# EAGLE board PKG900000001454 (EAGLE 7.7.0), part 1 of 2
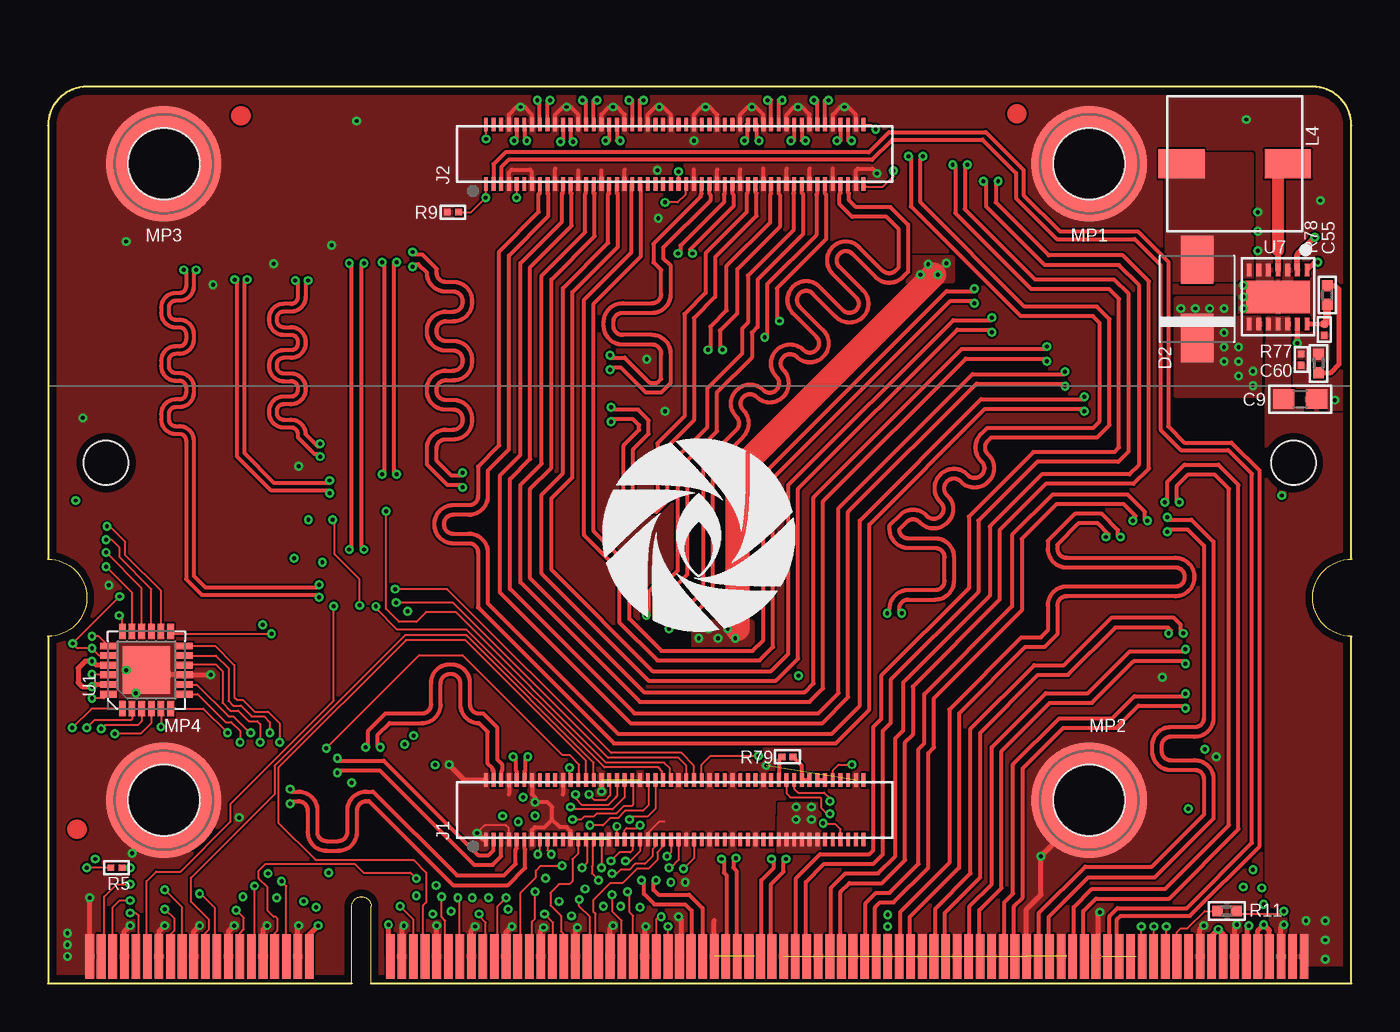
[diagram p5: board, top side]
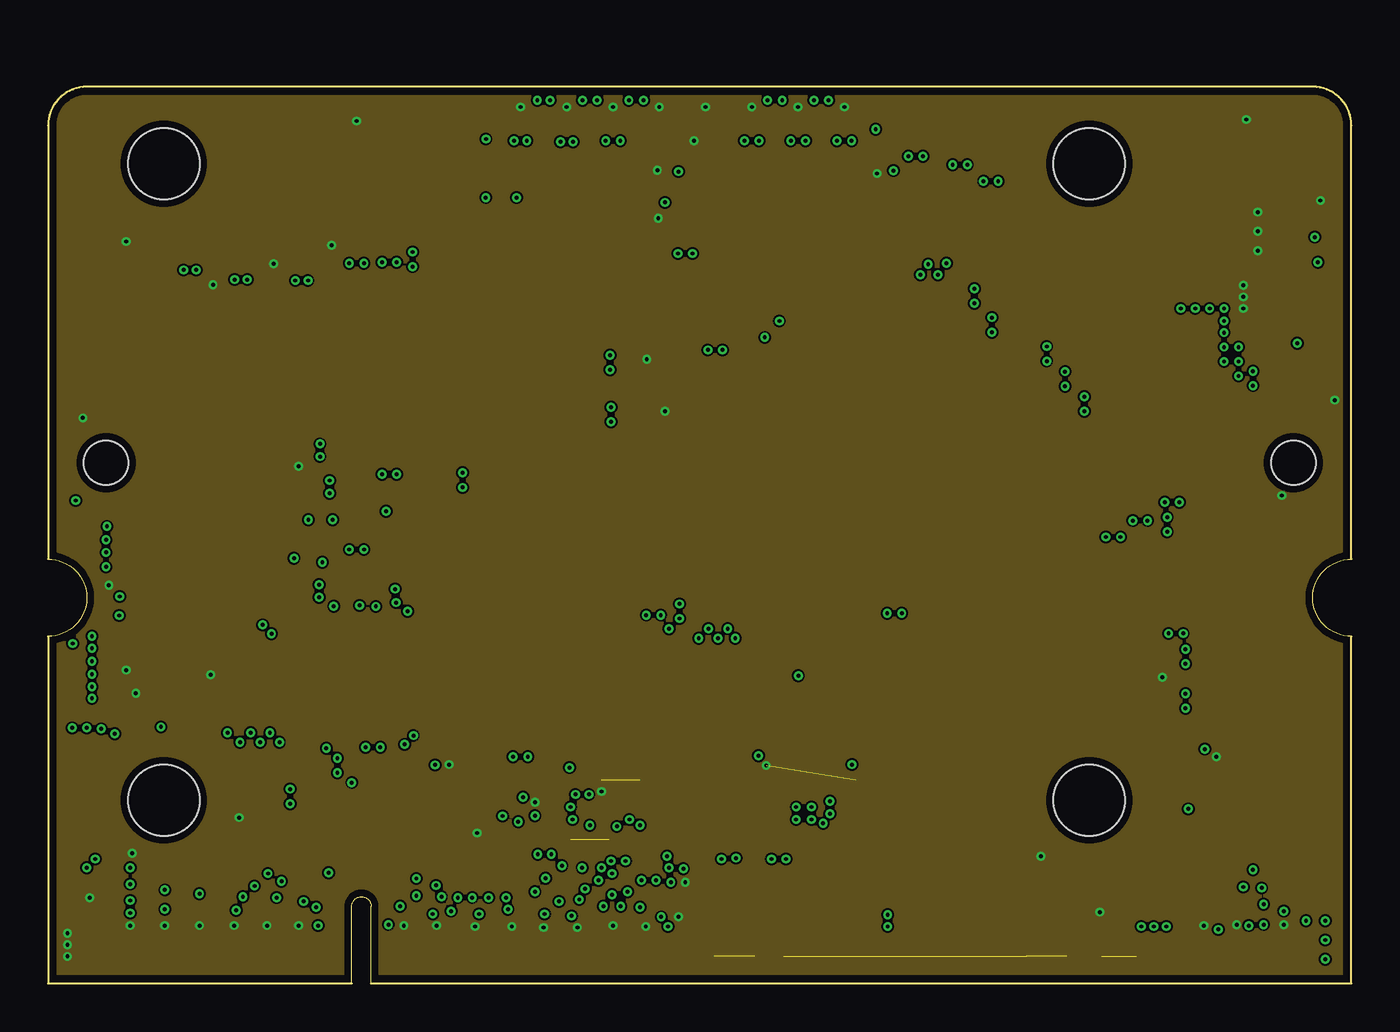
[diagram p6: board, inner layer GND]
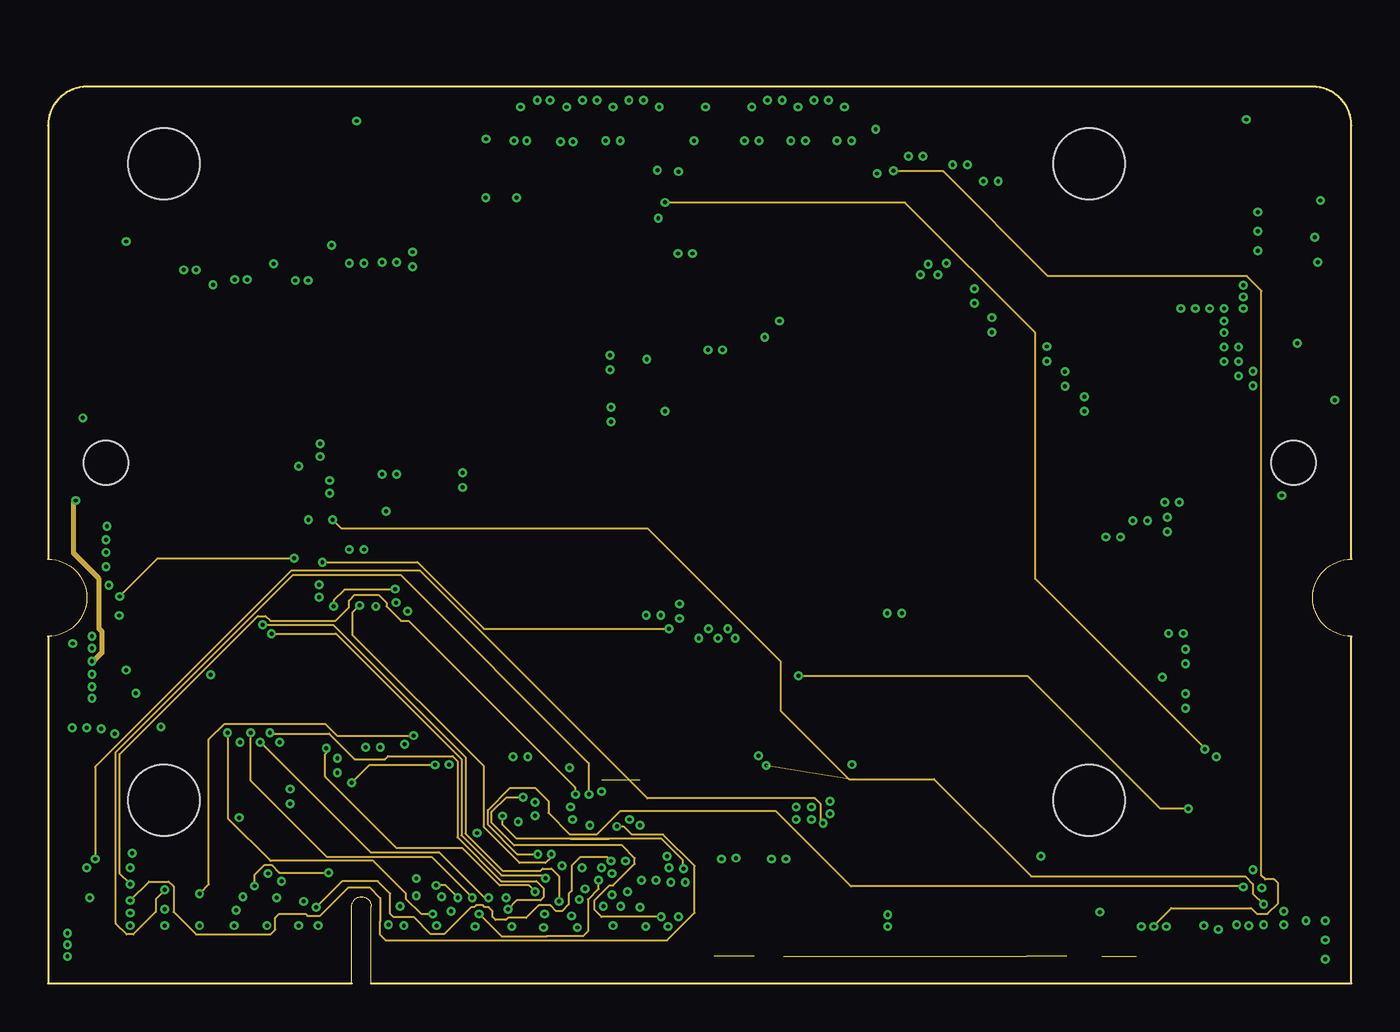
[diagram p7: board, inner layer S3]
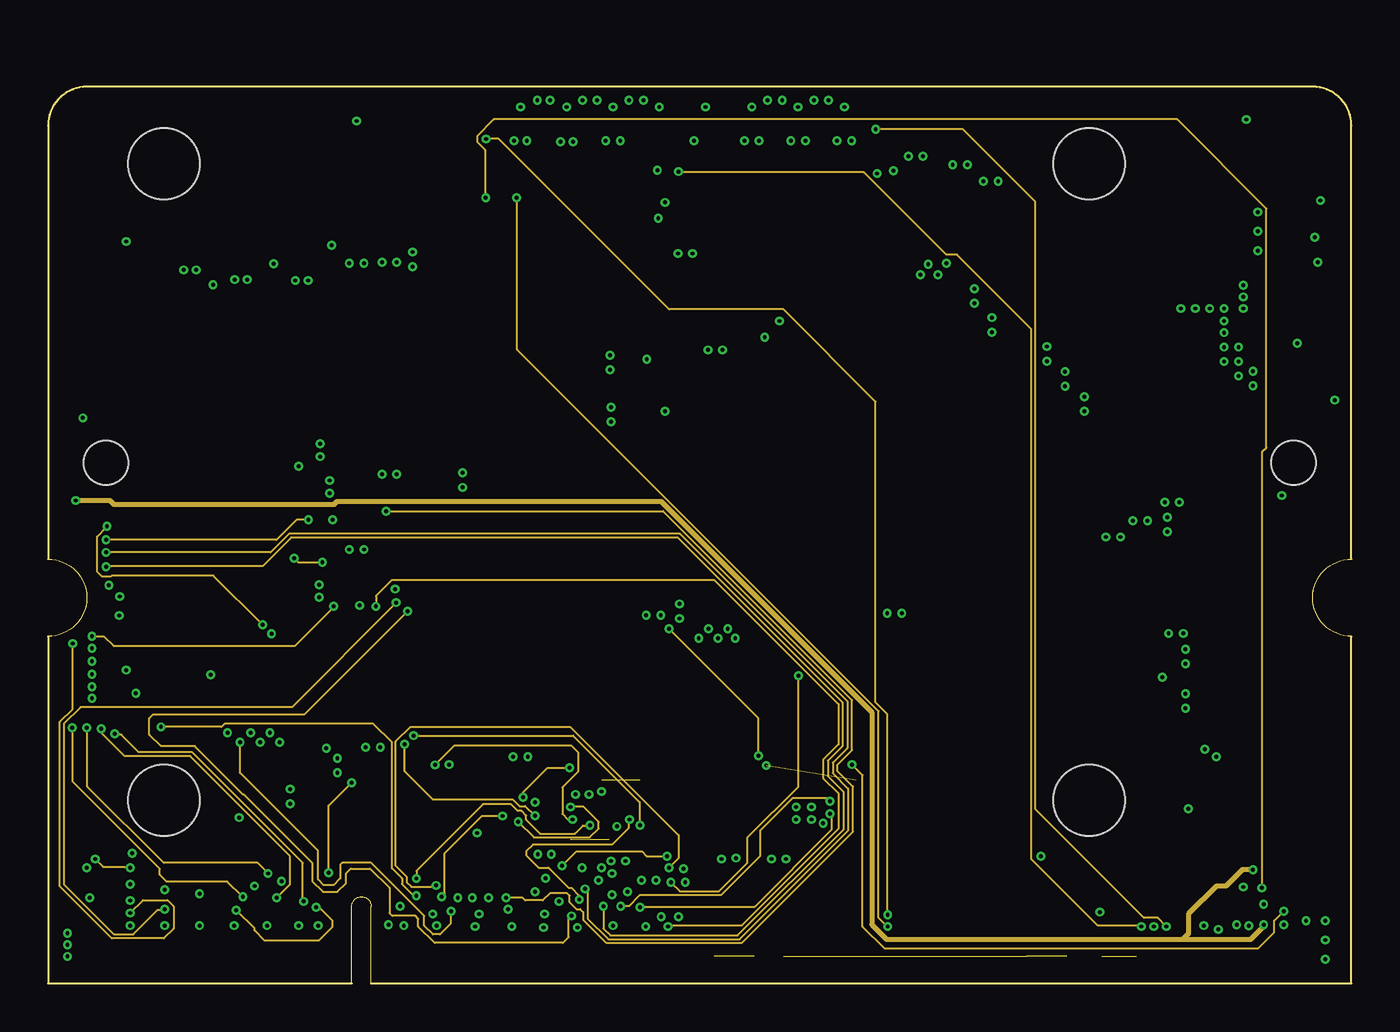
[diagram p8: board, inner layer S14]
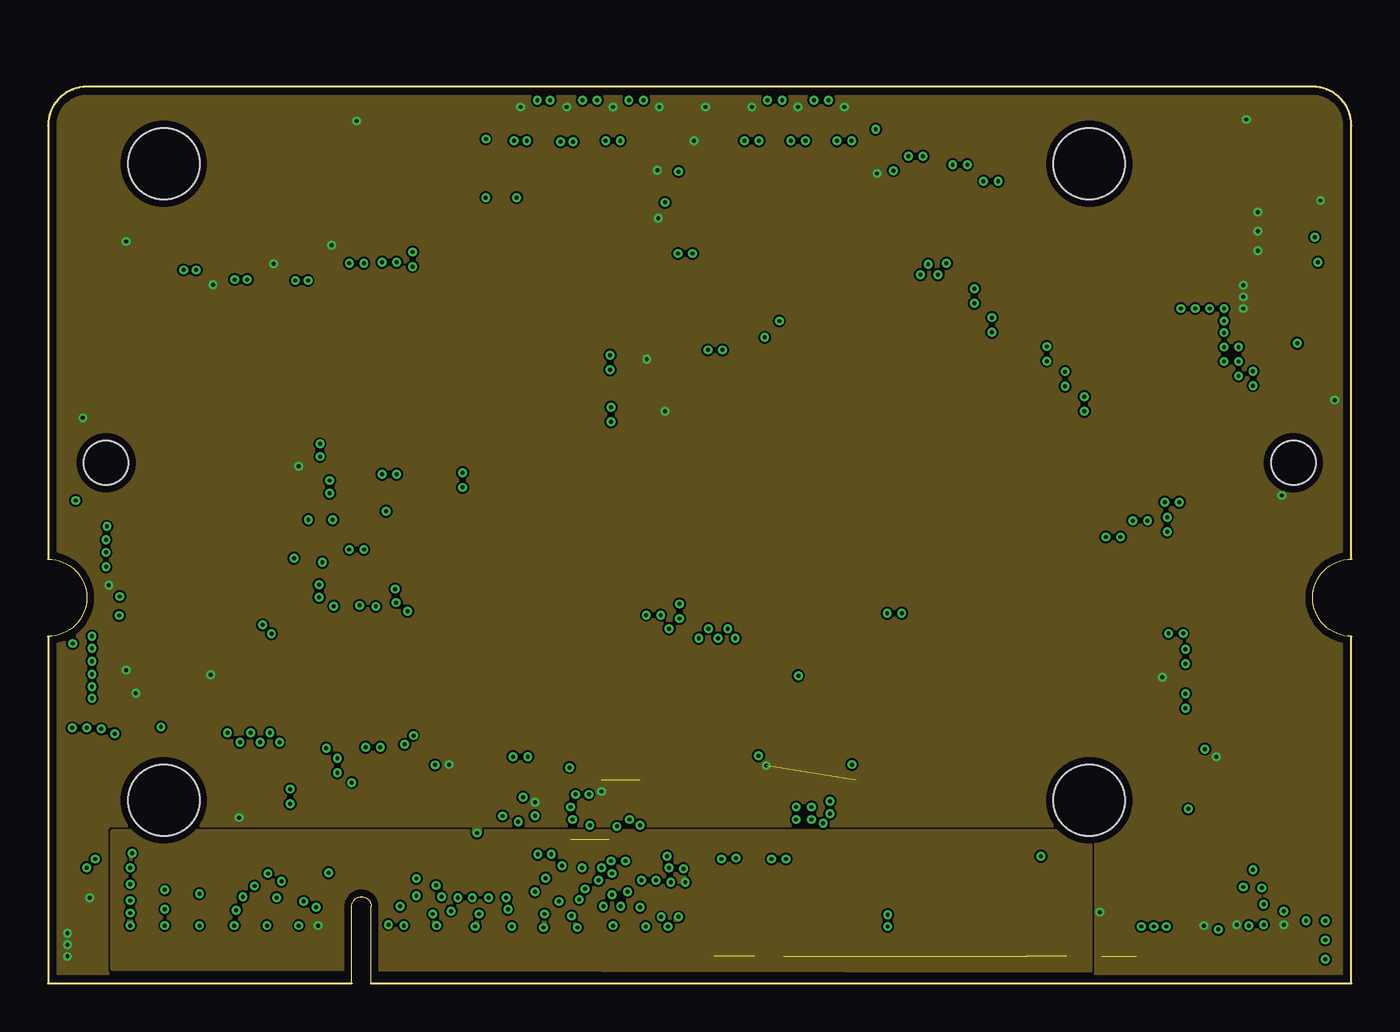
[diagram p9: board, inner layer Power]
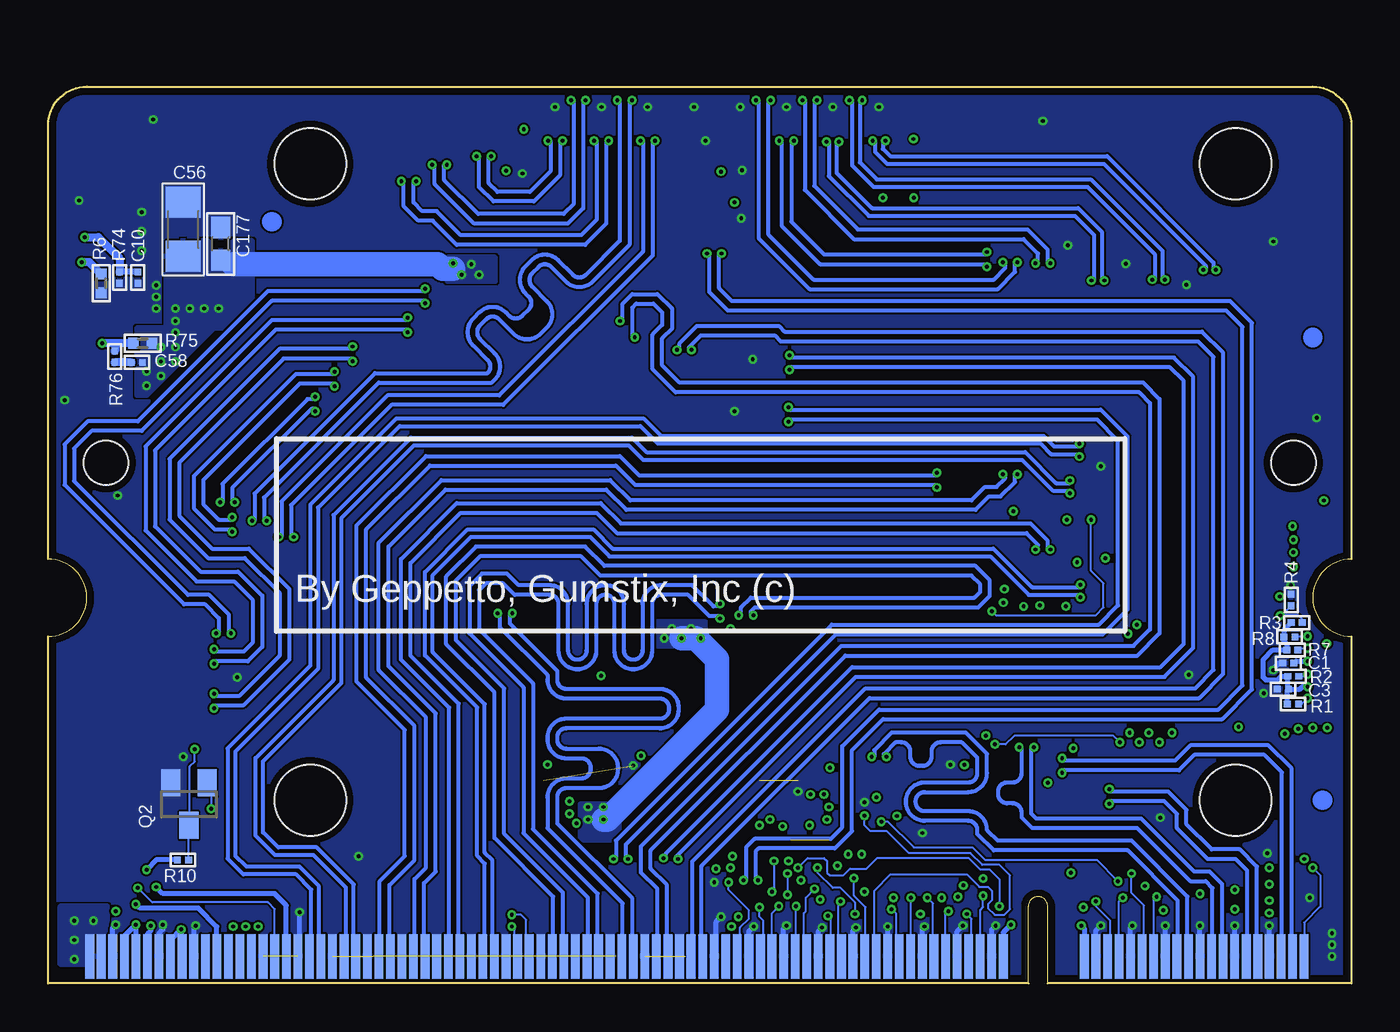
[diagram p10: board, bottom side, seen from below]

Size 67.6 x 46.5 mm. Coordinates in mm from the lower left corner, seen from the top.
Outline: 15.75,0 0,0 0,18
Outline: 16.75,0 67.6,0 67.6,18
Outline: 67.6,22 67.6,44.5 arc90 65.6,46.5 2,46.5 arc90 0,44.5 0,22
Copper layers (1+2*3+14*15+16): Top 0.035mm / dielectric 0.2mm / GND 0.035mm / dielectric 0.2mm / S3 0.035mm / dielectric 0.2mm / S14 0.035mm / dielectric 0.2mm / Power 0.035mm / dielectric 0.2mm / Bottom 0.035mm
Design rules "geppetto": minimum track width 4mil, minimum drill 8mil, track to track 4mil, track to pad 0.15mm, pad to pad 0.15mm, via to via 0.15mm, smd to smd 0mil, copper to edge 15mil, drill to drill 10mil, minimum pad ring 7mil, minimum via ring 5mil, stop-mask expansion 3mil, vias tented up to drill 20mil, thermal gap 0mil
Net classes: 1 supply: width 0.254 mm; 2 analog: width 0.178 mm; 5 USB: width 0.2 mm, clearance 0.2 mm; 6 HDMI: width 0.2 mm, clearance 0.3 mm; 7 50_OHM: width 0.378 mm, clearance 0.3 mm
Holes 2.3 mm at 3,27 64.6,27

## Footprints (pad centres in the part's own frame; a part is rotated, then mirrored left to right if it is on the bottom)
0201 = smd 0.356 x 0.33: 1 -0.292,0; 2 0.292,0
0603 = smd 1.1 x 1: 1 -0.85,0; 2 0.85,0
1206 = smd 1.6 x 1.8: 1 -1.4,0; 2 1.4,0
0402 = smd 0.559 x 0.559: 1 -0.483,0; 2 0.483,0
SMAJ = smd 2.5 x 1.7: A 2.032,0; C -2.032,0
HRS_DF40C-100DS-0.4V(51) = smd 0.2 x 0.7: 1 -9.8,-1.54; 2 -9.8,1.54; 3 -9.4,-1.54; 4 -9.4,1.54; 5 -9,-1.54; 6 -9,1.54; 7 -8.6,-1.54; 8 -8.6,1.54; 9 -8.2,-1.54; 10 -8.2,1.54; 11 -7.8,-1.54; 12 -7.8,1.54; 13 -7.4,-1.54; 14 -7.4,1.54; 15 -7,-1.54; 16 -7,1.54; 17 -6.6,-1.54; 18 -6.6,1.54; 19 -6.2,-1.54; 20 -6.2,1.54; 21 -5.8,-1.54; 22 -5.8,1.54; 23 -5.4,-1.54; 24 -5.4,1.54; 25 -5,-1.54; 26 -5,1.54; 27 -4.6,-1.54; 28 -4.6,1.54; 29 -4.2,-1.54; 30 -4.2,1.54; 31 -3.8,-1.54; 32 -3.8,1.54; 33 -3.4,-1.54; 34 -3.4,1.54; 35 -3,-1.54; 36 -3,1.54; 37 -2.6,-1.54; 38 -2.6,1.54; 39 -2.2,-1.54; 40 -2.2,1.54; 41 -1.8,-1.54; 42 -1.8,1.54; 43 -1.4,-1.54; 44 -1.4,1.54; 45 -1,-1.54; 46 -1,1.54; 47 -0.6,-1.54; 48 -0.6,1.54; 49 -0.2,-1.54; 50 -0.2,1.54; 51 0.2,-1.54; 52 0.2,1.54; 53 0.6,-1.54; 54 0.6,1.54; 55 1,-1.54; 56 1,1.54; 57 1.4,-1.54; 58 1.4,1.54; 59 1.8,-1.54; 60 1.8,1.54; 61 2.2,-1.54; 62 2.2,1.54; 63 2.6,-1.54; 64 2.6,1.54; 65 3,-1.54; 66 3,1.54; 67 3.4,-1.54; 68 3.4,1.54; 69 3.8,-1.54; 70 3.8,1.54; 71 4.2,-1.54; 72 4.2,1.54; 73 4.6,-1.54; 74 4.6,1.54; 75 5,-1.54; 76 5,1.54; 77 5.4,-1.54; 78 5.4,1.54; 79 5.8,-1.54; 80 5.8,1.54; 81 6.2,-1.54; 82 6.2,1.54; 83 6.6,-1.54; 84 6.6,1.54; 85 7,-1.54; 86 7,1.54; 87 7.4,-1.54; 88 7.4,1.54; 89 7.8,-1.54; 90 7.8,1.54; 91 8.2,-1.54; 92 8.2,1.54; 93 8.6,-1.54; 94 8.6,1.54; 95 9,-1.54; 96 9,1.54; 97 9.4,-1.54; 98 9.4,1.54; 99 9.8,-1.54; 100 9.8,1.54
B82462 = smd 2.4 x 1.5: 1 -2.75,0; 2 2.75,0
WA-SMSI_9774___151 = smd 6 x 6: 1 0,0 | hole 3.7: 0,0
SOT23 = smd 1 x 1.4: 1 -0.95,-1.1; 2 0.95,-1.1; 3 0,1.1
WQFN24 = smd 2.45 x 2.45: 25 0,0 | smd 0.8 x 0.35: P1 -2,1.25; P2 -2,0.75; P3 -2,0.25; P4 -2,-0.25; P5 -2,-0.75; P6 -2,-1.25; P13 2,-1.25; P14 2,-0.75; P15 2,-0.25; P16 2,0.25; P17 2,0.75; P18 2,1.25 | smd 0.35 x 0.85: P7 -1.25,-1.975; P8 -0.75,-1.975; P9 -0.25,-1.975; P10 0.25,-1.975; P11 0.75,-1.975; P12 1.25,-1.975; P19 1.25,1.975; P20 0.75,1.975; P21 0.25,1.975; P22 -0.25,1.975; P23 -0.75,1.975; P24 -1.25,1.975
DFN-14 = smd 0.65 x 0.25: 1 -1.4,1.5; 2 -1.4,1; 3 -1.4,0.5; 4 -1.4,0; 5 -1.4,-0.5; 6 -1.4,-1; 7 -1.4,-1.5; 8 1.4,-1.5; 9 1.4,-1; 10 1.4,-0.5; 11 1.4,0; 12 1.4,0.5; 13 1.4,1; 14 1.4,1.5 | smd 1.7 x 3.3: P$1 0,0
SLOT-1376408-1_1.8V_MOD = smd 0.45 x 2.3: 1 2.15,1.4; 3 2.75,1.4; 5 3.35,1.4; 7 3.95,1.4; 9 4.55,1.4; 11 5.15,1.4; 13 5.75,1.4; 15 6.35,1.4; 17 6.95,1.4; 19 7.55,1.4; 21 8.15,1.4; 23 8.75,1.4; 25 9.35,1.4; 27 9.95,1.4; 29 10.55,1.4; 31 11.15,1.4; 33 11.75,1.4; 35 12.35,1.4; 37 12.95,1.4; 39 13.55,1.4; 41 17.75,1.4; 43 18.35,1.4; 45 18.95,1.4; 47 19.55,1.4; 49 20.15,1.4; 51 20.75,1.4; 53 21.35,1.4; 55 21.95,1.4; 57 22.55,1.4; 59 23.15,1.4; 61 23.75,1.4; 63 24.35,1.4; 65 24.95,1.4; 67 25.55,1.4; 69 26.15,1.4; 71 26.75,1.4; 73 27.35,1.4; 75 27.95,1.4; 77 28.55,1.4; 79 29.15,1.4; 81 29.75,1.4; 83 30.35,1.4; 85 30.95,1.4; 87 31.55,1.4; 89 32.15,1.4; 91 32.75,1.4; 93 33.35,1.4; 95 33.95,1.4; 97 34.55,1.4; 99 35.15,1.4; 101 35.75,1.4; 103 36.35,1.4; 105 36.95,1.4; 107 37.55,1.4; 109 38.15,1.4; 111 38.75,1.4; 113 39.35,1.4; 115 39.95,1.4; 117 40.55,1.4; 119 41.15,1.4; 121 41.75,1.4; 123 42.35,1.4; 125 42.95,1.4; 127 43.55,1.4; 129 44.15,1.4; 131 44.75,1.4; 133 45.35,1.4; 135 45.95,1.4; 137 46.55,1.4; 139 47.15,1.4; 141 47.75,1.4; 143 48.35,1.4; 145 48.95,1.4; 147 49.55,1.4; 149 50.15,1.4; 151 50.75,1.4; 153 51.35,1.4; 155 51.95,1.4; 157 52.55,1.4; 159 53.15,1.4; 161 53.75,1.4; 163 54.35,1.4; 165 54.95,1.4; 167 55.55,1.4; 169 56.15,1.4; 171 56.75,1.4; 173 57.35,1.4; 175 57.95,1.4; 177 58.55,1.4; 179 59.15,1.4; 181 59.75,1.4; 183 60.35,1.4; 185 60.95,1.4; 187 61.55,1.4; 189 62.15,1.4; 191 62.75,1.4; 193 63.35,1.4; 195 63.95,1.4; 197 64.55,1.4; 199 65.15,1.4 | smd 0.45 x 2.3 bottom: 2 2.45,1.4; 4 3.05,1.4; 6 3.65,1.4; 8 4.25,1.4; 10 4.85,1.4; 12 5.45,1.4; 14 6.05,1.4; 16 6.65,1.4; 18 7.25,1.4; 20 7.85,1.4; 22 8.45,1.4; 24 9.05,1.4; 26 9.65,1.4; 28 10.25,1.4; 30 10.85,1.4; 32 11.45,1.4; 34 12.05,1.4; 36 12.65,1.4; 38 13.25,1.4; 40 13.85,1.4; 42 18.05,1.4; 44 18.65,1.4; 46 19.25,1.4; 48 19.85,1.4; 50 20.45,1.4; 52 21.05,1.4; 54 21.65,1.4; 56 22.25,1.4; 58 22.85,1.4; 60 23.45,1.4; 62 24.05,1.4; 64 24.65,1.4; 66 25.25,1.4; 68 25.85,1.4; 70 26.45,1.4; 72 27.05,1.4; 74 27.65,1.4; 76 28.25,1.4; 78 28.85,1.4; 80 29.45,1.4; 82 30.05,1.4; 84 30.65,1.4; 86 31.25,1.4; 88 31.85,1.4; 90 32.45,1.4; 92 33.05,1.4; 94 33.65,1.4; 96 34.25,1.4; 98 34.85,1.4; 100 35.45,1.4; 102 36.05,1.4; 104 36.65,1.4; 106 37.25,1.4; 108 37.85,1.4; 110 38.45,1.4; 112 39.05,1.4; 114 39.65,1.4; 116 40.25,1.4; 118 40.85,1.4; 120 41.45,1.4; 122 42.05,1.4; 124 42.65,1.4; 126 43.25,1.4; 128 43.85,1.4; 130 44.45,1.4; 132 45.05,1.4; 134 45.65,1.4; 136 46.25,1.4; 138 46.85,1.4; 140 47.45,1.4; 142 48.05,1.4; 144 48.65,1.4; 146 49.25,1.4; 148 49.85,1.4; 150 50.45,1.4; 152 51.05,1.4; 154 51.65,1.4; 156 52.25,1.4; 158 52.85,1.4; 160 53.45,1.4; 162 54.05,1.4; 164 54.65,1.4; 166 55.25,1.4; 168 55.85,1.4; 170 56.45,1.4; 172 57.05,1.4; 174 57.65,1.4; 176 58.25,1.4; 178 58.85,1.4; 180 59.45,1.4; 182 60.05,1.4; 184 60.65,1.4; 186 61.25,1.4; 188 61.85,1.4; 190 62.45,1.4; 192 63.05,1.4; 194 63.65,1.4; 196 64.25,1.4; 198 64.85,1.4; 200 65.45,1.4

## Placement (x,y rotation side)
C1  0.1uF  [0201]  3.27,16.61 180 bottom
C3  0.1uF  [0201]  3.55,15.26 180 bottom
C9  10uF  [0603]  64.95,30.3 0 top
C10  0.1uF  [0201]  62.95,36.6 270 bottom
C55  10pF  [0201]  66.2,33.9 270 top
C56  100uF  [1206]  60.6,39.1 90 bottom
C58  47pF  [0201]  63,32.2 180 bottom
C60  1nF  [0402]  65.9,32.15 90 top
C177  4.7uF  [0603]  58.65,38.35 90 bottom
D2  MBRA140T3G  [SMAJ]  59.6,35.5 90 top
FD1  DNP  [FIDUCIAL]  1.5,8 0 top
FD2  DNP  [FIDUCIAL]  50.25,45.1 0 top
FD3  DNP  [FIDUCIAL]  10,45 0 top
FD4  DNP  [FIDUCIAL]  2,33.5 0 bottom
FD5  DNP  [FIDUCIAL]  56,39.5 0 bottom
FD6  DNP  [FIDUCIAL]  1.5,9.5 0 bottom
J1  DF40C-100DS-0.4V(51)  [HRS_DF40C-100DS-0.4V(51)]  32.5,9 0 top
J2  DF40C-100DS-0.4V(51)  [HRS_DF40C-100DS-0.4V(51)]  32.5,43 0 top
L4  4.7uH  [B82462]  61.55,42.5 180 top
MP1  9774015151R  [WA-SMSI_9774___151]  54,42.5 180 top
MP2  9774015151R  [WA-SMSI_9774___151]  54,9.5 180 top
MP3  9774015151R  [WA-SMSI_9774___151]  6,42.5 180 top
MP4  9774015151R  [WA-SMSI_9774___151]  6,9.5 180 top
Q2  BSS138  [SOT23]  60.3,9.3 180 bottom
R1  10K 1%  [0201]  3.03,14.49 180 bottom
R2  10K 1%  [0201]  3.01,15.93 180 bottom
R3  DNP  [0201]  2.83,18.71 180 bottom
R4  0R  [0201]  3.12,19.88 270 bottom
R5  0R  [0201]  3.55,6 180 top
R6  33K2  [0402]  64.85,36.3 90 bottom
R7  DNP  [0201]  3.06,17.29 180 bottom
R8  DNP  [0201]  3.21,17.97 180 bottom
R9  DNP  [0201]  21,40 0 top
R10  10K 1%  [0201]  60.6,6.4 180 bottom
R11  220R  [0402]  61.15,3.75 0 top
R74  180K  [0201]  63.9,36.6 90 bottom
R75  560K  [0402]  62.7,33.2 0 bottom
R76  0R  [0201]  64.15,32.5 270 bottom
R77  180K  [0201]  65,32.35 90 top
R78  8K2  [0402]  66.35,35.7 270 top
R79  0R  [0201]  38.35,11.75 180 top
U1  TCA6416A  [WQFN24]  5.1,16.25 90 top
U7  LTC3533  [DFN-14]  63.8,35.6 270 top
U$3  DNP  [GEPPETTO_LABEL]  55.75,18.25 0 bottom
U$4  DNP  [GEPPETTO_LOGO_SILK10]  33.75,23.25 0 top
X1  DNP  [SLOT-1376408-1_1.8V_MOD]  0,0 0 top

## Tracks (layer width: path | path; a pad name or v marks a point on that pad's centre or on a via)
1.3.3V_VCC_3.3  (via drill 0.2)
  Top 0.254: U1.P21 2.48,16.5 v2.27,16.71 1.91,16.71 1.55,16.35 1.55,15.6 1.76,15.39 v2.27,15.39 2.38,15.5 U1.P23 | X1.191 62.75,2.75 v63.05,3.05 63.35,2.75 X1.193
  S3 0.254: v1.42,25.04 1.32,25.04 1.32,22.3 2.64,20.98 2.64,18.39 2.79,18.24 2.79,17.17 2.33,16.71 v2.27,16.71
  S14 0.254: 58.85,2.29 43.48,2.29 42.72,3.05 42.72,14.07 31.8,24.99 14.99,24.99 14.83,24.84 3.4,24.84 3.2,25.04 v1.42,25.04 | 58.85,2.29 62.38,2.29 63.04,2.95 v63.04,3.05 v63.05,3.05 | v62.5,5.9 61.95,5.9 61.1,5.05 60.6,5.05 59.15,3.6 59.15,2.59 58.85,2.29
  Bottom 0.254: C1.1 2.88,16.71 v2.27,16.71 | R3.2 3.5,18.33 R8.2 3.5,17.75 3.35,17.6 R7.2 4.06,17.29 4.58,16.77 4.58,15.88 4.44,15.74 3.82,15.74 3.63,15.93 R2.2 3.3,15.3 C3.1 | C3.1 2.67,15.26 2.54,15.39 v2.27,15.39 | R1.2 3.32,15.2 C3.1 | X1.192 v63.05,3.05 63.65,2.45 X1.194 | R10.2 62,6.4 v62.5,5.9
1.8V_OUT$2
  Top 0.2: J1.90 J1.88
1.VBAT_VCC_3.3  (via drill 0.2)
  other vias: 65.25,3.25 66.25,3.25 66.25,2.25 66.25,1.25
  pour Top: 64.35,34.5 64.3,29.6 63.25,29.6 63.3,34.5
  pour Top: 67.25,1 64.5,1 64.5,4 63.25,4 63.25,30 65,30 65,29.5 67.25,29.5
  pour Bottom: 67,1 64.5,1 64.5,4 67,4
1V8  (via drill 0.2)
  Top 0.254: X1.183 60.35,2.45 v60.7,2.8 60.95,2.55 X1.185
  Bottom 0.254: X1.184 60.7,1.45 v60.7,2.8 61.25,2.25 X1.186
2.CAM0_C_N  (via drill 0.2)
  Top 0.2: J2.40 30.3,45.8 v30.12,45.8 30.25,45.8 | v18.08,26.4 17.95,26.4 17.95,37.4 v18.08,37.4
  Bottom 0.2: v30.12,45.8 30.25,45.8 30.25,38.85 27.9,36.5 18.55,36.5 17.95,37.1 17.95,37.4 v18.08,37.4 | v18.08,26.4 17.95,26.4 17.95,26.2 18.4,25.75 19,25.75 19.7,25.05 37.4,25.05 38.45,26.1 47.2,26.1 50.45,22.85 50.45,16.25 48,13.8 48,6 48.6,5.4 48.6,1.45 X1.144
2.CAM0_C_P  (via drill 0.2)
  Top 0.2: J2.42 30.7,45.8 v30.88,45.8 30.75,45.8 | v17.32,26.4 17.45,26.4 17.45,37.4 v17.32,37.4
  Bottom 0.2: v30.88,45.8 30.75,45.8 30.75,38.65 28.1,36 18.35,36 17.45,36.9 17.45,37.4 v17.32,37.4 | v17.32,26.4 17.45,26.4 17.45,26 18.2,25.25 18.8,25.25 19.5,24.55 37.6,24.55 38.65,25.6 47,25.6 49.95,22.65 49.95,16.45 47.5,14 47.5,5.8 48.1,5.2 48.1,1.45 X1.142
2.CAM0_D1_N  (via drill 0.2)
  Top 0.2: J2.28 27.9,45.8 v27.72,45.8 27.85,45.8 | v15.62,37.35 15.75,37.35 15.75,22.5 v15.62,22.5
  Bottom 0.2: v27.72,45.8 27.85,45.8 27.85,41.35 25.6,39.1 16.8,39.1 15.75,38.05 15.75,37.35 v15.62,37.35 | X1.138 46.8,1.45 46.8,14.3 49.3,16.8 49.3,22 46.4,24.9 38.95,24.9 37.9,23.85 16.65,23.85 15.75,22.95 15.75,22.5 v15.62,22.5
2.CAM0_D1_P  (via drill 0.2)
  Top 0.2: J2.30 28.3,45.8 v28.48,45.8 28.35,45.8 | v16.38,37.35 16.25,37.35 16.25,22.5 v16.38,22.5
  Bottom 0.2: v28.48,45.8 28.35,45.8 28.35,41.15 25.8,38.6 17,38.6 16.25,37.85 16.25,37.35 v16.38,37.35 | X1.136 46.3,1.45 46.3,14.5 48.8,17 48.8,21.8 46.2,24.4 39.15,24.4 38.1,23.35 16.85,23.35 16.25,22.75 16.25,22.5 v16.38,22.5
2.CAM0_D2_N  (via drill 0.2)
  Top 0.2: J2.34 29.1,43.7 v28.92,43.7 29.05,43.7 | v18.9,37.93 18.9,37.8 19.4,37.8 20.15,37.05 20.15,36.85 arc90 20.62,36.37 21.03,36.37 arc-90 22,35.4 22,35.32 arc-90 21.03,34.34 20.62,34.34 arc90 20.15,33.87 20.15,33.78 arc90 20.62,33.31 21.03,33.31 arc-90 22,32.34 22,32.26 arc-90 21.03,31.28 20.62,31.28 arc90 20.15,30.8 20.15,30.72 arc90 20.62,30.25 21.03,30.25 arc-90 22,29.27 22,29.19 arc-90 21.03,28.22 20.62,28.22 arc90 20.15,27.74 20.15,27.1 20.9,26.35 21.5,26.35 v21.5,26.48
  Bottom 0.2: v28.92,43.7 29.05,43.7 29.05,39.5 27.35,37.8 18.9,37.8 v18.9,37.93 | v21.5,26.48 21.5,26.35 36.95,26.35 37.95,27.35 48,27.35 51.6,23.75 51.6,15.65 49.1,13.15 49.1,6.6 50.4,5.3 50.4,1.45 X1.150
2.CAM0_D2_P  (via drill 0.2)
  Top 0.2: J2.36 29.5,43.7 v29.68,43.7 29.55,43.7 | v18.9,37.17 18.9,37.3 19.2,37.3 19.65,36.85 arc90 20.62,35.87 21.03,35.87 arc-90 21.5,35.4 21.5,35.32 arc-90 21.03,34.84 20.62,34.84 arc90 19.65,33.87 19.65,33.78 arc90 20.62,32.81 21.03,32.81 arc-90 21.5,32.34 21.5,32.26 arc-90 21.03,31.78 20.62,31.78 arc90 19.65,30.8 19.65,30.72 arc90 20.62,29.75 21.03,29.75 arc-90 21.5,29.27 21.5,29.19 arc-90 21.03,28.72 20.62,28.72 arc90 19.65,27.74 19.65,26.9 20.7,25.85 21.5,25.85 v21.5,25.72
  Bottom 0.2: v29.68,43.7 29.55,43.7 29.55,39.3 27.55,37.3 18.9,37.3 v18.9,37.17 | v21.5,25.72 21.5,25.85 37.15,25.85 38.15,26.85 47.8,26.85 51.1,23.55 51.1,15.85 48.6,13.35 48.6,6.4 49.9,5.1 49.9,1.45 X1.148
2.CAM1_C_N  (via drill 0.2)
  Top 0.2: v51.8,32.27 51.8,32.4 47.6,32.4 40.2,25 40.2,15.3 39.5,14.6 30.7,14.6 24.5,20.8 24.5,25.85 25.6,26.95 25.6,36.7 27.85,38.95 27.85,40.96 27.9,40.96 J2.27 | v59,14.27 59,14.4 56.55,14.4 55.4,13.25 52.65,13.25 50.55,11.15 50.55,4.45 50.1,4 50.1,1.45 X1.149
  Bottom 0.2: v51.8,32.27 51.8,32.4 55.4,32.4 60.8,27 60.8,24.25 59.1,22.55 57.2,22.55 55.1,20.45 55.1,16.8 57.5,14.4 59,14.4 v59,14.27
2.CAM1_C_P  (via drill 0.2)
  Top 0.2: v51.8,33.03 51.8,32.9 47.4,32.9 39.7,25.2 39.7,15.55 39.25,15.1 30.9,15.1 25,21 25,25.65 26.1,26.75 26.1,36.5 28.35,38.75 28.35,40.96 28.3,40.96 J2.29 | v59,15.03 59,14.9 56.35,14.9 55.2,13.75 52.45,13.75 50.05,11.35 50.05,4.65 49.6,4.2 49.6,1.45 X1.147
  Bottom 0.2: v51.8,33.03 51.8,32.9 55.6,32.9 61.3,27.2 61.3,24.05 59.3,22.05 57.4,22.05 55.6,20.25 55.6,17 57.7,14.9 59,14.9 v59,15.03
2.CAM1_D1_N  (via drill 0.2)
  Top 0.2: v53.75,29.67 53.75,29.8 48.6,29.8 42.6,23.8 42.6,14.2 40.85,12.45 29.35,12.45 22.3,19.5 22.3,22.35 arc90 21.82,22.82 21,22.82 arc-90 20.02,23.8 20.02,23.82 arc-90 21,24.8 21.82,24.8 arc90 22.3,25.27 22.3,26.8 23.4,27.9 23.4,37.95 25.45,40 25.45,40.96 25.5,40.96 J2.15 | v57.92,24.95 58.05,24.95 58.05,26 58.95,26.9 60.7,26.9 61.75,25.85 61.75,8 58.15,4.4 54.35,4.4 53.7,3.75 53.7,1.4 X1.161
  Bottom 0.2: v53.75,29.67 53.75,29.8 53.95,29.8 58.05,25.7 58.05,24.95 v57.92,24.95
2.CAM1_D1_P  (via drill 0.2)
  Top 0.2: v53.75,30.43 53.75,30.3 48.4,30.3 42.1,24 42.1,14.4 40.65,12.95 29.55,12.95 22.8,19.7 22.8,22.35 arc90 21.82,23.32 21,23.32 arc-90 20.52,23.8 20.52,23.82 arc-90 21,24.3 21.82,24.3 arc90 22.8,25.27 22.8,26.6 23.9,27.7 23.9,37.75 25.95,39.8 25.95,40.95 25.9,40.95 J2.17 | v58.68,24.95 58.55,24.95 58.55,25.8 59.15,26.4 60.5,26.4 61.25,25.65 61.25,8.2 57.95,4.9 54.15,4.9 53.2,3.95 53.2,1.4 X1.159
  Bottom 0.2: v53.75,30.43 53.75,30.3 54.15,30.3 58.55,25.9 58.55,24.95 v58.68,24.95
2.CAM1_D2_N  (via drill 0.2)
  Top 0.2: v52.75,30.97 52.75,31.1 48.15,31.1 41.5,24.45 41.5,14.85 40.15,13.5 30.2,13.5 23.45,20.25 23.45,26.35 24.5,27.4 24.5,37.35 26.65,39.5 26.65,40.96 26.7,40.96 J2.21 | v58.05,24.18 58.05,24.05 59.3,24.05 60.45,22.9 60.45,13.76 arc-90 59.48,12.79 58.23,12.79 arc90 57.76,12.31 57.76,12.05 arc90 58.23,11.57 59.48,11.57 arc-90 60.45,10.6 60.45,8.55 57.4,5.5 53.95,5.5 51.9,3.45 51.9,1.45 X1.155
  Bottom 0.2: v52.75,30.97 52.75,31.1 54.55,31.1 59.55,26.1 59.55,24.85 58.75,24.05 58.05,24.05 v58.05,24.18
2.CAM1_D2_P  (via drill 0.2)
  Top 0.2: v52.75,31.73 52.75,31.6 47.95,31.6 41,24.65 41,15.05 39.95,14 30.4,14 23.95,20.45 23.95,26.15 25,27.2 25,37.15 27.15,39.3 27.15,40.96 27.1,40.96 J2.23 | v58.05,23.42 58.05,23.55 59.1,23.55 59.95,22.7 59.95,13.76 arc-90 59.48,13.29 58.23,13.29 arc90 57.26,12.31 57.26,12.05 arc90 58.23,11.07 59.48,11.07 arc-90 59.95,10.6 59.95,8.75 57.25,6.05 53.8,6.05 51.4,3.65 51.4,1.45 X1.153
  Bottom 0.2: v52.75,31.73 52.75,31.6 54.75,31.6 60.05,26.3 60.05,24.65 58.95,23.55 58.05,23.55 v58.05,23.42
2.CAM1_D3_N  (via drill 0.2)
  Top 0.2: v48.95,33.77 48.95,33.9 47.15,33.9 38.9,25.65 38.9,16.85 37.75,15.7 31.15,15.7 25.6,21.25 25.6,25.35 26.7,26.45 26.7,36.05 29.05,38.4 29.05,40.96 29.1,40.96 J2.33 | v59,16.57 59,16.7 56.3,16.7 54.15,14.55 51.95,14.55 49.45,12.05 49.45,4.95 48.3,3.8 48.3,1.45 X1.143
  Bottom 0.2: v48.95,33.77 48.95,33.9 55.8,33.9 62.05,27.65 62.05,23.7 59.7,21.35 57.75,21.35 56.5,20.1 56.5,17.45 57.25,16.7 59,16.7 v59,16.57
2.CAM1_D3_P  (via drill 0.2)
  Top 0.2: v48.95,34.53 48.95,34.4 46.95,34.4 38.4,25.85 38.4,17.1 37.5,16.2 31.35,16.2 26.1,21.45 26.1,25.15 27.2,26.25 27.2,35.85 29.55,38.2 29.55,40.96 29.5,40.96 J2.35 | v59,17.33 59,17.2 56.1,17.2 53.95,15.05 51.75,15.05 48.95,12.25 48.95,5.15 47.8,4 47.8,1.45 X1.141
  Bottom 0.2: v48.95,34.53 48.95,34.4 56,34.4 62.55,27.85 62.55,23.5 59.9,20.85 57.95,20.85 57,19.9 57,17.65 57.45,17.2 59,17.2 v59,17.33
2.CAM1_D4_N  (via drill 0.2)
  Top 0.2: v48.05,35.27 48.05,35.4 46.8,35.4 37.6,26.2 37.6,17.45 36.9,16.75 31.6,16.75 29.65,18.7 29.65,21.4 27.8,23.25 27.8,35.45 30.25,37.9 30.25,41.41 J2.39 | v58.12,18.15 58.25,18.15 58.25,18.3 58.1,18.45 55.35,18.45 52.9,16 51.35,16 48.35,13 48.35,5.5 46.5,3.65 46.5,1.45 X1.137
  Bottom 0.2: v48.05,35.27 48.05,35.4 56,35.4 62.75,28.65 65.35,28.65 66.25,27.75 66.25,26.05 60.35,20.15 59.25,20.15 58.25,19.15 58.25,18.15 v58.12,18.15
2.CAM1_D4_P  (via drill 0.2)
  Top 0.2: v48.05,36.03 48.05,35.9 46.6,35.9 37.1,26.4 37.1,17.8 36.55,17.25 31.8,17.25 30.15,18.9 30.15,21.6 28.3,23.45 28.3,35.25 30.75,37.7 30.75,41.41 J2.41 | v58.88,18.15 58.75,18.15 58.75,18.6 58.4,18.95 55.15,18.95 52.7,16.5 51.15,16.5 47.85,13.2 47.85,5.7 46,3.85 46,1.45 X1.135
  Bottom 0.2: v48.05,36.03 48.05,35.9 56.2,35.9 62.95,29.15 65.55,29.15 66.75,27.95 66.75,25.85 60.55,19.65 59.45,19.65 58.75,18.95 58.75,18.15 v58.88,18.15
2.DSI0_C_N  (via drill 0.2)
  Top 0.2: J2.69 36.3,41 36.25,40.95 36.25,40 34.1,37.85 34.1,35.8 33,34.7 33,29.4 31.6,28 31.6,25.2 31.35,24.95 30.65,24.95 30.35,25.25 30.35,27.7 31.15,28.5 31.15,29.2 30.6,29.75 29.2,29.75 v29.2,29.88 | v37.52,6.45 37.65,6.45 37.65,6 37,5.35 37,1.4 X1.105
  Bottom 0.2: v29.2,29.88 29.2,29.75 13,29.75 11.6,28.35 11.6,19.4 12.9,18.1 26.75,18.1 37.65,7.2 37.65,6.45 v37.52,6.45
2.DSI0_C_P  (via drill 0.2)
  Top 0.2: J2.71 36.7,41 36.75,40.95 36.75,39.8 34.6,37.65 34.6,35.6 33.5,34.5 33.5,29.2 32.1,27.8 32.1,25 31.55,24.45 30.45,24.45 29.85,25.05 29.85,27.9 30.65,28.7 30.65,28.95 30.35,29.25 29.2,29.25 v29.2,29.12 | v38.28,6.45 38.15,6.45 38.15,5.8 37.5,5.15 37.5,1.4 X1.107
  Bottom 0.2: v29.2,29.12 29.2,29.25 13.2,29.25 12.1,28.15 12.1,19.6 13.1,18.6 26.95,18.6 38.15,7.4 38.15,6.45 v38.28,6.45
2.DSI0_D1_N  (via drill 0.2)
  Top 0.2: v34.92,6.45 35.05,6.45 35.05,5.75 35.2,5.6 35.2,1.4 X1.99 | J2.57 33.9,40.95 33.85,40.9 33.85,40.8 31.4,38.35 31.4,37.4 31.8,37 31.8,35.75 arc-90 31.32,35.27 29.8,35.27 arc90 28.82,34.3 28.82,34.1 arc90 29.8,33.13 31.32,33.13 arc-90 31.8,32.65 31.8,31.35 31.6,31.15 31.2,31.15 29.9,32.45 29.15,32.45 v29.15,32.58 29.28,32.58
  Bottom 0.2: v29.15,32.58 29.15,32.45 9.2,32.45 8.2,31.45 8.2,17.4 9.7,15.9 25.7,15.9 35.02,6.57 35.02,6.45 v34.92,6.45
2.DSI0_D1_P  (via drill 0.2)
  Top 0.2: v35.68,6.5 35.55,6.5 35.55,6 35.7,5.85 35.7,1.4 X1.101 | J2.59 34.3,40.95 34.35,40.9 34.35,40.6 31.9,38.15 31.9,37.6 32.3,37.2 32.3,35.75 arc-90 31.32,34.77 29.8,34.77 arc90 29.32,34.3 29.32,34.1 arc90 29.8,33.63 31.32,33.63 arc-90 32.3,32.65 32.3,31.15 31.8,30.65 31,30.65 29.7,31.95 29.15,31.95 v29.15,31.82
  Bottom 0.2: v35.68,6.5 35.55,6.5 35.55,6.75 25.9,16.4 9.9,16.4 8.7,17.6 8.7,31.25 9.4,31.95 29.15,31.95 v29.15,31.82
2.DSI0_D2_N  (via drill 0.2)
  Top 0.2: v30.77,5.35 30.9,5.35 30.9,4.65 31.45,4.1 33.05,4.1 33.37,3.77 33.37,1.4 X1.93 | J2.63 35.1,40.95 35.05,40.9 35.05,40.5 32.8,38.25 32.8,37.85 v32.67,37.85
  Bottom 0.2: v32.67,37.85 32.8,37.85 32.8,36.05 32.15,35.4 6.3,35.4 5.15,34.25 5.15,15.25 6.7,13.7 24.3,13.7 25.9,12.1 25.9,7.9 26.8,7 30.75,7 30.9,6.85 30.9,5.35 v30.77,5.35
2.DSI0_D2_P  (via drill 0.2)
  Top 0.2: v31.53,5.35 31.4,5.35 31.4,4.85 31.65,4.6 33.25,4.6 33.95,3.9 X1.95 | J2.65 35.5,40.95 35.55,40.9 35.55,40.3 33.3,38.05 33.3,37.85 v33.43,37.85
  Bottom 0.2: v33.43,37.85 33.3,37.85 33.3,35.85 32.35,34.9 6.5,34.9 5.65,34.05 5.65,15.45 6.9,14.2 24.5,14.2 26.4,12.3 26.4,8.1 27,7.5 30.95,7.5 31.4,7.05 31.4,5.35 v31.53,5.35
2.DSI1_C_N  (via drill 0.2)
  Top 0.2: J2.87 39.9,40.95 39.85,40.9 39.85,38.8 37.3,36.25 37.3,33.5 v37.17,33.5
  Bottom 0.2: v37.17,33.5 37.3,33.5 37.3,35.05 37.1,35.25 36.2,35.25 35.75,34.8 35.75,34.15 36.25,33.65 36.25,31.85 35.05,30.65 11,30.65 10.45,30.1 10.45,18.35 11.3,17.5 26.45,17.5 36.85,7.1 36.85,5.75 36,4.9 36,1.4 X1.102
2.DSI1_C_P  (via drill 0.2)
  Top 0.2: J2.89 40.3,40.95 40.35,40.9 40.35,38.6 37.8,36.05 37.8,34.35 v37.93,34.35
  Bottom 0.2: v37.93,34.35 37.8,34.35 37.8,35.25 37.3,35.75 36,35.75 35.25,35 35.25,33.95 35.75,33.45 35.75,32.05 34.85,31.15 10.8,31.15 9.95,30.3 9.95,18.15 11.1,17 26.25,17 36.35,6.9 36.35,5.95 35.5,5.1 35.5,1.4 X1.100
2.DSI1_D0_N  (via drill 0.2)
  Top 0.2: J2.75 37.5,40.95 37.45,40.9 37.45,39.45 35.2,37.2 35.2,34.9 34.35,34.05 34.35,32.85 v34.22,32.85
  Bottom 0.2: v34.22,32.85 34.35,32.85 34.35,33 33.75,33.6 29.9,33.6 29.6,33.3 7.95,33.3 7.15,32.5 7.15,16.25 8.1,15.3 25.2,15.3 34.2,6.3 34.2,1.4 X1.96
2.DSI1_D0_P  (via drill 0.2)
  Top 0.2: J2.77 37.9,40.95 37.95,40.9 37.95,39.25 35.75,37.05 35.75,34.75 34.85,33.85 34.85,32.85 v34.98,32.85
  Bottom 0.2: v34.98,32.85 34.85,32.85 34.85,33.2 33.95,34.1 29.7,34.1 29.4,33.8 7.75,33.8 6.65,32.7 6.65,16.05 7.9,14.8 25,14.8 33.7,6.1 33.7,1.4 X1.94
2.DSI1_D1_N  (via drill 0.2)
  Top 0.2: J2.81 38.7,41 38.65,40.95 38.65,39.05 36.3,36.7 36.3,34.25 36,33.95 36,32.65 34.2,30.85 34.2,28.85 32.65,27.3 32.65,21.4 32.35,21.1 31.95,21.1 31.15,20.3 31.15,19.1 v31.02,19.1
  Bottom 0.2: X1.120 41.4,1.4 41.4,4.5 44.45,7.55 44.45,15.1 46.95,17.6 46.95,21.1 45.4,22.65 39.75,22.65 38.75,21.65 19.5,21.65 18.75,20.9 18.75,20.1 19.35,19.5 30.95,19.5 31.15,19.3 31.15,19.1 v31.02,19.1
2.DSI1_D1_P  (via drill 0.2)
  Top 0.2: J2.83 39.1,41 39.15,40.95 39.15,38.85 36.8,36.5 36.8,34.05 36.5,33.75 36.5,32.45 34.7,30.65 34.7,28.65 33.15,27.1 33.15,21.2 32.55,20.6 32.15,20.6 31.65,20.1 31.65,19.1 v31.78,19.1
  Bottom 0.2: X1.118 40.9,1.4 40.9,4.7 43.95,7.75 43.95,15.3 46.45,17.8 46.45,20.9 45.2,22.15 39.95,22.15 38.95,21.15 19.7,21.15 19.25,20.7 19.25,20.3 19.55,20 31.15,20 31.65,19.5 31.65,19.1 v31.78,19.1
2.DSI1_D2_N  (via drill 0.2)
  Top 0.2: v32.75,19.68 32.75,19.55 33.2,19.55 34,20.35 34,27 35.7,28.71 arc90 35.7,29.38 arc-90 35.7,30.76 35.72,30.77 arc-90 37.1,30.77 arc90 37.77,30.77 37.78,30.79 arc90 37.78,31.46 arc-90 37.78,32.84 37.8,32.85 arc-90 39.18,32.85 arc90 39.85,32.85 arc90 39.85,33.52 38.62,34.75 arc-90 38.62,36.12 38.63,36.13 arc-90 40.01,36.13 41.23,34.91 arc90 41.9,34.91 41.91,34.91 arc90 41.91,35.58 40.68,36.8 arc-90 40.68,38.18 40.69,38.19 arc-90 42.07,38.19 43.29,36.97 arc90 43.96,36.97 44.1,37.1 44.1,39.15 43.5,39.75 41.7,39.75 41.05,40.4 41.05,40.95 41.1,41 J2.93
  Bottom 0.2: v32.75,19.68 32.75,19.55 33.1,19.55 34.2,20.65 35.8,20.65 arc-90 36.77,19.68 36.77,17.26 arc90 37.25,16.79 | X1.114 39.6,1.4 39.6,4.45 42.95,7.8 42.95,15.35 45.75,18.15 45.75,20.6 45.1,21.25 43.8,21.25 43.2,20.65 41.6,20.65 arc90 40.62,19.68 40.62,17.26 arc-90 40.15,16.79 | 37.25,16.79 | 37.25,16.79 arc90 37.72,17.26 37.72,19.68 arc-90 38.7,20.65 38.7,20.65 arc-90 39.67,19.68 39.67,17.26 arc90 40.15,16.79 | 40.15,16.79
2.DSI1_D2_P  (via drill 0.2)
  Top 0.2: v32.75,18.92 32.75,19.05 33.4,19.05 34.5,20.15 34.5,26.8 36.06,28.35 arc90 36.06,29.73 arc-90 36.06,30.41 36.07,30.42 arc-90 36.74,30.42 arc90 38.12,30.42 38.14,30.43 arc90 38.14,31.81 arc-90 38.14,32.48 38.15,32.5 arc-90 38.82,32.5 arc90 40.2,32.5 arc90 40.2,33.88 38.98,35.1 arc-90 38.98,35.77 38.98,35.78 arc-90 39.66,35.78 40.88,34.55 arc90 42.26,34.55 42.26,34.56 arc90 42.26,35.94 41.04,37.16 arc-90 41.04,37.83 41.04,37.83 arc-90 41.71,37.83 42.94,36.61 arc90 44.31,36.61 44.6,36.9 44.6,39.35 43.7,40.25 41.9,40.25 41.55,40.6 41.55,40.95 41.5,41 J2.95
  Bottom 0.2: v32.75,18.92 32.75,19.05 33.3,19.05 34.4,20.15 35.8,20.15 arc-90 36.27,19.68 36.27,17.26 arc90 37.25,16.29 | X1.112 39.1,1.4 39.1,4.65 42.45,8 42.45,15.55 45.25,18.35 45.25,20.4 44.9,20.75 44,20.75 43.4,20.15 41.6,20.15 arc90 41.12,19.68 41.12,17.26 arc-90 40.15,16.29 | 37.25,16.29 | 37.25,16.29 arc90 38.22,17.26 38.22,19.68 arc-90 38.7,20.15 38.7,20.15 arc-90 39.17,19.68 39.17,17.26 arc90 40.15,16.29 | 40.15,16.29
2.DSI1_D3_N  (via drill 0.2)
  Top 0.2: J2.94 41.1,43.7 v40.92,43.7 41.05,43.7 | 45.25,42.77 45.25,42.9 v45.38,42.9 45.25,42.77 | v44.28,19.2 44.15,19.2 44.15,19.43 arc-90 44.62,19.91 46.02,19.91 arc90 47,20.88 47,22.1 arc90 46.02,23.07 44.62,23.07 arc-90 44.15,23.55 44.53,23.92 arc-90 45.2,23.92 45.25,23.88 arc90 46.62,23.88 46.66,23.91 arc90 46.66,25.29 46.61,25.34 arc-90 46.61,26.01 46.65,26.04 arc-90 47.32,26.04 47.37,26 arc90 48.74,26 48.78,26.03 arc90 48.78,27.41 48.73,27.46 arc-90 48.73,28.13 48.9,28.3 54.4,28.3 55.05,28.95 55.05,34.45 54.4,35.1 50.65,35.1 45.25,40.5 45.25,42.77
  Bottom 0.2: v40.92,43.7 41.05,43.7 41.05,41.9 42.4,40.55 44.5,40.55 45.25,41.3 45.25,42.9 v45.38,42.9 | v44.28,19.2 44.15,19.2 44.15,18.45 41.7,16 41.7,15.75 arc-90 40.73,14.78 35.88,14.78 arc90 35.4,14.3 35.4,14.2 arc90 35.88,13.73 40.73,13.73 arc-90 41.7,12.75 41.7,12.65 arc-90 40.73,11.68 39.94,11.68 arc90 39.47,11.2 39.47,11.1 arc90 39.94,10.62 40.73,10.62 arc-90 41.7,9.65 41.7,8.05 37.8,4.15 37.8,1.4 X1.108
2.DSI1_D3_P  (via drill 0.2)
  Top 0.2: J2.96 41.5,43.7 v41.68,43.7 41.55,43.7 | v44.62,42.9 44.75,42.9 44.75,40.3 50.45,34.6 54.2,34.6 54.55,34.25 54.55,29.15 54.2,28.8 48.7,28.8 48.38,28.48 arc90 48.38,27.1 48.43,27.05 arc-90 48.43,26.38 48.39,26.35 arc-90 47.72,26.35 47.67,26.4 arc90 46.29,26.4 46.26,26.36 arc90 46.26,24.98 46.31,24.93 arc-90 46.31,24.26 46.27,24.23 arc-90 45.6,24.23 45.55,24.28 arc90 44.17,24.28 43.65,23.75 43.65,23.55 arc90 44.62,22.57 46.02,22.57 arc-90 46.5,22.1 46.5,20.88 arc-90 46.02,20.41 44.62,20.41 arc90 43.65,19.43 43.65,19.2 v43.52,19.2
  Bottom 0.2: v41.68,43.7 41.55,43.7 41.55,42.1 42.6,41.05 44.3,41.05 44.75,41.5 44.75,42.9 v44.62,42.9 | v43.52,19.2 43.65,19.2 43.65,18.65 41.2,16.2 41.2,15.75 arc-90 40.73,15.28 35.88,15.28 arc90 34.9,14.3 34.9,14.2 arc90 35.88,13.23 40.73,13.23 arc-90 41.2,12.75 41.2,12.65 arc-90 40.73,12.18 39.02,12.18 arc90 38.05,11.2 38.05,11.1 arc90 39.02,10.12 40.73,10.12 arc-90 41.2,9.65 41.2,8.3 37.3,4.4 37.3,1.4 X1.106
2.HDMI0_CEC  (via drill 0.2)
  Top 0.102: J2.51 v32.7,42.1 | X1.171 56.7,1.4 v56.7,2.95
  S14 0.102: v32.7,42.1 32.72,42.06 42.32,42.06 46.58,37.8 47.14,37.8 51,33.93 51,6.45 54.46,3 56.69,3 v56.7,2.95
2.HDMI0_CLOCK_N  (via drill 0.2)
  Top 0.2: 40.35,45.8 v40.48,45.8 40.3,45.8 J2.90 | v46.92,42.45 47.05,42.45 47.05,39.95 51,36 55.05,36 55.55,35.5 55.55,27.8 55.3,27.55 51.1,27.55 47.75,24.2 47.75,20.5 43.2,15.95 43.2,13.7 42.8,13.3 42.8,6.9 42.6,6.7 40.05,6.7 38.8,5.45 38.8,1.4 X1.111
  Bottom 0.2: v40.48,45.8 40.35,45.8 40.35,40.4 40.85,39.9 45.3,39.9 47.05,41.65 47.05,42.45 v46.92,42.45
2.HDMI0_CLOCK_P  (via drill 0.2)
  Top 0.2: 39.85,45.8 v39.72,45.8 39.9,45.8 J2.88 | v47.68,42.45 47.55,42.45 47.55,40.15 51.2,36.5 55.3,36.5 56.05,35.75 56.05,27.6 55.5,27.05 51.3,27.05 48.25,24 48.25,20.3 43.7,15.75 43.7,13.5 43.3,13.1 43.3,6.7 42.8,6.2 40.25,6.2 39.3,5.25 39.3,1.4 X1.113
  Bottom 0.2: v39.72,45.8 39.85,45.8 39.85,40.2 40.65,39.4 45.5,39.4 47.55,41.45 47.55,42.45 v47.68,42.45
2.HDMI0_D0_N  (via drill 0.2)
  Top 0.2: J2.84 39.1,43.7 v39.28,43.7 39.15,43.7 | v48.52,41.6 48.65,41.6 48.65,40.3 51.7,37.25 55.55,37.25 56.6,36.2 56.6,26.9 56.1,26.4 51.55,26.4 48.85,23.7 48.85,20.1 44.35,15.6 44.35,13.1 43.95,12.7 43.95,6.6 43.05,5.7 41.35,5.7 40.6,4.95 40.6,1.4 X1.117
  Bottom 0.2: v39.28,43.7 39.15,43.7 39.15,39.6 39.95,38.8 46.2,38.8 47.45,40.05 48.2,40.05 48.65,40.5 48.65,41.6 v48.52,41.6
2.HDMI0_D0_P  (via drill 0.2)
  Top 0.2: J2.82 38.7,43.7 v38.52,43.7 38.65,43.7 | v49.28,41.6 49.15,41.6 49.15,40.5 51.9,37.75 55.75,37.75 57.1,36.4 57.1,26.7 56.3,25.9 51.75,25.9 49.35,23.5 49.35,19.9 44.85,15.4 44.85,12.9 44.45,12.5 44.45,6.4 43.25,5.2 41.55,5.2 41.1,4.75 41.1,1.4 X1.119
  Bottom 0.2: v38.52,43.7 38.65,43.7 38.65,39.4 39.75,38.3 46.4,38.3 47.65,39.55 48.4,39.55 49.15,40.3 49.15,41.6 v49.28,41.6
2.HDMI0_D1_N  (via drill 0.2)
  Top 0.2: 37.95,45.8 v38.08,45.8 37.9,45.8 J2.78 | v57.03,24 56.9,24 56.9,24.45 56,25.35 52.1,25.35 50,23.25 50,19.55 45.45,15 45.45,12.45 45.15,12.15 45.15,6.2 43.65,4.7 42.95,4.7 42.4,4.15 42.4,1.4 X1.123
  Bottom 0.2: v38.08,45.8 37.95,45.8 37.95,38.5 39.71,36.74 arc90 40.38,36.74 41.14,37.5 arc-90 42.52,37.5 42.85,37.17 arc-90 42.85,35.79 42.68,35.62 arc90 42.68,34.95 43.01,34.62 arc90 43.68,34.62 43.86,34.79 arc-90 45.23,34.79 45.56,34.46 arc-90 45.56,33.08 44.8,32.32 arc90 44.8,31.65 50.65,31.65 56.9,25.4 56.9,24 v57.03,24
2.HDMI0_D1_P  (via drill 0.2)
  Top 0.2: 37.45,45.8 v37.32,45.8 37.5,45.8 J2.76 | v56.27,24 56.4,24 56.4,24.25 55.8,24.85 52.3,24.85 50.5,23.05 50.5,19.35 45.95,14.8 45.95,12.25 45.65,11.95 45.65,6 43.85,4.2 43.15,4.2 42.9,3.95 42.9,1.4 X1.125
  Bottom 0.2: v37.32,45.8 37.45,45.8 37.45,38.3 39.36,36.39 arc90 40.74,36.39 41.5,37.15 arc-90 42.17,37.15 42.5,36.82 arc-90 42.5,36.15 41.74,35.39 arc90 41.74,34.01 42.07,33.68 arc90 43.45,33.68 44.21,34.44 arc-90 44.88,34.44 45.21,34.11 arc-90 45.21,33.44 44.45,32.67 arc90 44.45,31.3 44.6,31.15 50.45,31.15 56.4,25.2 56.4,24 v56.27,24
2.HDMI0_D2_N  (via drill 0.2)
  Top 0.2: J2.72 36.75,44.54 36.75,43.7 v36.88,43.7 | v55.63,23.15 55.5,23.15 55.5,23.5 54.65,24.35 53.25,24.35 51.85,22.95 51.85,22.55 arc90 52.83,21.57 58.48,21.57 arc-90 58.95,21.1 58.95,21.05 arc-90 58.48,20.57 52.83,20.57 arc90 51.85,19.6 51.85,18.3 51.5,17.95 50.5,17.95 46.75,14.2 46.75,6.25 44.2,3.7 44.2,1.4 X1.129
  Bottom 0.2: v36.88,43.7 36.75,43.7 36.75,37.95 44.2,30.5 50,30.5 55.5,25 55.5,23.15 v55.63,23.15
2.HDMI0_D2_P  (via drill 0.2)
  Top 0.2: J2.70 36.25,44.54 36.25,43.7 v36.12,43.7 | v54.87,23.15 55,23.15 55,23.3 54.45,23.85 53.45,23.85 52.35,22.75 52.35,22.55 arc90 52.83,22.07 58.48,22.07 arc-90 59.45,21.1 59.45,21.05 arc-90 58.48,20.07 52.83,20.07 arc90 52.35,19.6 52.35,18.1 51.7,17.45 50.7,17.45 47.25,14 47.25,6 44.7,3.45 44.7,1.4 X1.131
  Bottom 0.2: v36.12,43.7 36.25,43.7 36.25,37.75 44,30 49.8,30 55,24.8 55,23.15 v54.87,23.15
2.HDMI0_DDC_SCL  (via drill 0.2)
  Top 0.102: X1.175 58,1.4 v58,2.95 | v42.93,44.3 42.72,44.5 42.32,44.5 J2.100
  S14 0.102: v42.93,44.3 47.45,44.3 51.21,40.54 51.21,9.04 56.84,3.4 57.56,3.4 57.96,3 v58,2.95
2.HDMI0_DDC_SDA  (via drill 0.2)
  Top 0.102: X1.173 v57.35,2.95 | J2.99 42.46,41.3 43.3,41.3 43.85,41.85 v43.85,42.15
  S3 0.102: v43.85,42.15 43.89,42.11 46.43,42.11 51.87,36.68 62.18,36.68 62.94,35.92 62.94,5.59 63.13,5.4 63.6,5.4 63.8,5.2 63.8,4.15 63.25,3.6 62.7,3.6 62.4,3.9 58.26,3.9 57.35,3 v57.35,2.95
2.HDMI0_HPD  (via drill 0.2)
  Top 0.102: J2.53 33.05,41.41 33.05,40.9 32.65,40.5 v32,40.5
  S3 0.102: v32,40.5 32,40.49 44.45,40.49 51.21,33.73 51.21,20.98 60,12.19 v60,12.15
  Bottom 0.102: v60,12.15 60,11.5 60.25,11.25 60.25,8.25 Q2.3 R10.1
2.I2C_SCL  (via drill 0.2)
  Top 0.102: J1.80 38.3,9.85 38.5,9.65 40.05,9.65 40.1,9.6 40.1,9.1 40.4,8.8 v40.55,8.8
  S14 0.102: v30.7,3.95 30.73,3.96 36.63,3.96 40.64,7.98 40.64,8.74 40.59,8.79 v40.55,8.8
  Bottom 0.102: X1.84 30.7,1.45 30.5,1.65 30.5,3.25 30.7,3.45 v30.7,3.95
2.I2C_SDA  (via drill 0.2)
  Top 0.102: J1.82 38.7,10.1 38.9,9.9 40.25,9.9 40.55,9.6 v40.55,9.45
  S14 0.102: v29.7,4 29.72,4.01 30.12,4.01 30.68,4.57 34.9,4.57 36.93,6.6 36.93,7.92 38.61,9.6 40.44,9.6 40.54,9.5 v40.55,9.45
  Bottom 0.102: X1.82 30.05,3.65 v29.7,4
2.USB_OTG_D_N
  Top 0.2: J2.3 23.1,42.48 23.72,43.1 42.57,43.1 43.62,44.15 48.63,44.15 50.6,42.18 50.6,40.88 52.48,39 56.53,39 58.1,37.43 58.1,28.88 58.93,28.05 61.38,28.05 62.85,26.58 62.85,7.12 59.23,3.5 55.63,3.5 55.45,3.32 55.45,1.4 X1.167
2.USB_OTG_D_P
  Top 0.2: J2.5 23.5,42.32 23.88,42.7 42.73,42.7 43.78,43.75 48.47,43.75 50.2,42.02 50.2,40.72 52.32,38.6 56.37,38.6 57.7,37.27 57.7,28.72 58.77,27.65 61.22,27.65 62.45,26.42 62.45,7.28 59.07,3.9 55.47,3.9 55.05,3.48 55.05,1.4 X1.165
2.USB_OTG_ID  (via drill 0.2)
  Top 0.102: J2.1 v22.7,40.75 21.95,40 R9.2
  S14 0.102: v22.7,40.75 22.66,40.79 22.66,43.23 22.25,43.64 22.25,43.94 23.11,44.81 58.57,44.81 63.2,40.18 63.2,27.79 62.99,27.58 62.99,4.98 v62.95,4.95
  Bottom 0.102: X1.168 55.85,3.85 56.2,4.2 62.2,4.2 v62.95,4.95
3.3V_OUT$2
  Top 0.2: R79.1 39.1,11.29 J1.84 J1.86
4.VCC_5.0_VCC_5.0  (via drill 0.2)
  Top 1.27: 45.95,36.75 35.75,26.55 35.75,18.4
  Bottom 1.27: 46.6,37.05 47.15,37.05 47.4,37.3 58,37.3 | v34.75,17.9 34,17.9 32.9,16.8 32.9,14.2 38.6,8.5 v38.8,8.5
  other vias: 39.6,9.15 35.64,17.9 35.25,18.4 34.25,18.4 33.75,17.9 38.8,9.15 39.6,8.5 46.15,36.75 45.65,37.3 45.25,36.75 46.6,37.35 61,33.75 61,33 61,32.25 61.75,32.25 61.75,33 61.75,31.5 62.5,31 62.5,31.75 58.75,35 59.5,35 60.25,35 61,35 61,34.35
  pour Top (rank 3): 40,9.3 39.95,6.85 37.9,6.85 37.95,9.3
  pour Top: 33.5,18.75 36.5,18.75 36.5,17.5 33.5,17.5
  pour Bottom: 33.5,18.75 36.5,18.75 36.5,17.5 33.5,17.5
  pour Bottom: 37.95,9.3 40,9.3 40,7.45 37.95,7.45
  pour Top: 44.4,37.65 46.9,37.65 46.9,36.4 44.4,36.4
  pour Bottom: 44.4,37.65 46.9,37.65 46.9,36.4 44.4,36.4
  pour Bottom: 63,30.5 62.5,30.5 59,34 57,34 57,38.5 61.5,38.5 61.5,34 63,34
  pour Top: 58.5,35.5 58.5,30.5 62.85,30.5 62.9,34.5 61.5,34.5 61.5,35.5
!RPIBOOT$2  (via drill 0.2)
  Top 0.102: R5.1 v4.25,6 | J1.93 41.1,8 40.85,8.25 40.25,8.25 v40.2,8.3
  S3 0.102: v2.44,6.45 2.44,11.23 12.6,21.39 19.3,21.39 31.09,9.6 39.78,9.6 40.08,9.3 40.08,8.43 40.18,8.33 v40.2,8.3
  S14 0.102: v2.44,6.45 2.85,6.04 4.22,6.04 v4.25,6
ADDR$6  (via drill 0.2)
  Top 0.102: U1.P18 3.85,18.91 v3.68,19.08
  Bottom 0.102: R3.1 2.54,18.88 2.74,19.08 v3.68,19.08 3.63,19.08 R4.2
BURST$3  (via drill 0.2)
  Top 0.305: U7.2 64.8,37.8 v65.7,38.7
  Bottom 0.305: C10.1 R74.2
  Bottom 0.406: v65.7,38.7 65,38.7 63.9,37.6 R74.2
EMMC_!DISABLE$1  (via drill 0.2)
  Top 0.102: R5.2 v2,6
  Bottom 0.102: v2,6 1.6,5.6 1.6,4 2.45,3.15 X1.2
ETH_0_N  (via drill 0.2)
  Top 0.2: v24.12,11.75 24.25,11.75 24.25,11.05 24.3,11 J1.10
  Bottom 0.2: X1.24 9,1.4 9,4.3 11.6,6.9 18.55,6.9 19.4,7.75 19.4,7.95 arc-90 19.88,8.43 22.12,8.43 arc90 23.1,9.4 23.1,9.45 arc90 22.12,10.43 19.88,10.43 arc-90 19.4,10.9 19.4,11.7 20.2,12.5 21.3,12.5 arc-90 21.78,12.03 21.78,11.75 arc90 22.25,11.28 22.4,11.28 arc90 22.88,11.75 22.88,12.03 arc-90 23.35,12.5 23.65,12.5 24.25,11.9 24.25,11.75 v24.12,11.75
ETH_0_P  (via drill 0.2)
  Top 0.2: v24.88,11.75 24.75,11.75 24.75,11.05 24.7,11 J1.12
  Bottom 0.2: X1.22 8.5,1.4 8.5,4.5 11.4,7.4 18.35,7.4 18.9,7.95 arc-90 19.88,8.93 22.12,8.93 arc90 22.6,9.4 22.6,9.45 arc90 22.12,9.93 19.88,9.93 arc-90 18.9,10.9 18.9,11.9 20,13 23.85,13 24.75,12.1 24.75,11.75 v24.88,11.75
ETH_1_N  (via drill 0.2)
  Top 0.2: J1.6 23.5,11 23.55,11.05 23.55,11.35 23.3,11.6 23.3,13.25 22.55,14 22.35,14 arc-90 21.87,14.47 21.87,15.57 arc90 20.9,16.55 20.84,16.55 arc90 19.86,15.57 19.86,14.47 arc-90 19.39,14 17.5,14 16.6,13.1 16.6,12.25 v16.47,12.25
  Bottom 0.2: X1.16 6.7,1.4 6.7,5.15 7.35,5.8 8.15,5.8 10.9,8.55 16.35,8.55 16.6,8.8 16.6,12.25 v16.47,12.25
ETH_1_P  (via drill 0.2)
  Top 0.2: J1.4 23.1,11.05 23.05,11.05 23.05,11.15 22.8,11.4 22.8,13.05 22.35,13.5 arc-90 21.37,14.47 21.37,15.57 arc90 20.9,16.05 20.84,16.05 arc90 20.36,15.57 20.36,14.47 arc-90 19.39,13.5 17.7,13.5 17.1,12.9 17.1,12.25 v17.23,12.25
  Bottom 0.2: X1.18 7.2,1.4 7.2,4.95 7.55,5.3 8.35,5.3 11.1,8.05 16.55,8.05 17.1,8.6 17.1,8.86 arc-90 17.57,9.34 17.84,9.34 arc90 18.32,9.81 18.32,9.95 arc90 17.84,10.43 17.57,10.43 arc-90 17.1,10.9 17.1,12.25 v17.23,12.25
ETH_2_N  (via drill 0.2)
  Top 0.2: v12.55,10.08 12.55,9.95 12.98,9.95 arc-90 13.96,8.97 13.96,7.86 arc90 14.43,7.38 15.05,7.38 arc90 15.53,7.86 15.53,8.97 arc-90 16.5,9.95 16.85,9.95 21.2,5.6 23.65,5.6 24.25,6.2 24.25,6.95 24.3,7 J1.9
  Bottom 0.2: X1.10 4.9,1.4 4.9,6.05 5.8,6.95 7.25,6.95 8.55,8.25 8.55,9 9.5,9.95 12.55,9.95 v12.55,10.08
ETH_2_P  (via drill 0.2)
  Top 0.2: v12.55,9.32 12.55,9.45 12.98,9.45 arc-90 13.46,8.97 13.46,7.86 arc90 14.43,6.88 15.05,6.88 arc90 16.02,7.86 16.02,8.97 arc-90 16.5,9.45 16.65,9.45 21,5.1 23.85,5.1 24.75,6 24.75,6.95 24.7,7 J1.11
  Bottom 0.2: X1.12 5.4,1.4 5.4,5.85 6,6.45 7.45,6.45 9.05,8.05 9.05,8.8 9.7,9.45 12.55,9.45 v12.55,9.32
ETH_3_N  (via drill 0.2)
  Top 0.2: v15,10.92 15,11.05 17.2,11.05 22.1,6.15 23.05,6.15 23.5,6.6 J1.5
  Bottom 0.2: X1.6 3.6,1.4 3.6,10.95 4.5,11.85 8.15,11.85 8.95,11.05 15,11.05 v15,10.92
ETH_3_P  (via drill 0.2)
  Top 0.2: v15,11.68 15,11.55 17.4,11.55 22.3,6.65 22.85,6.65 23.1,6.9 J1.3
  Bottom 0.2: X1.4 3.1,1.4 3.1,11.15 4.3,12.35 8.35,12.35 9.15,11.55 15,11.55 v15,11.68
ETH_!GREEN  (via drill 0.2)
  Top 0.102: J1.15 25.5,6.8 v25.4,6.7
  S3 0.102: v25.4,6.7 v25.4,6.71 24.33,6.71 22.81,8.23 22.81,8.99 23.93,10.11 25.29,10.11 25.95,9.45 25.95,8.85 27.08,7.72 28.45,7.72 29.67,8.94 37.74,8.94 41.66,5.03 61.98,5.03 v62,5
  Bottom 0.254: X1.166 55.25,4.05 55.85,4.65 61.65,4.65 v62,5
ETH_!YELLOW  (via drill 0.2)
  Top 0.102: J1.17 25.9,6.9 v26.1,6.7 | v16.15,19.6 16.15,20.95 14.85,22.25 14.85,23.95 v14.75,24.05
  S3 0.102: v26.1,6.7 26.1,6.55 25.8,6.25 24.45,6.25 22.6,8.1 22.6,11.25 15.8,18.05 15.8,19.25 v16.15,19.6 | v14.75,24.05 15.2,23.6 31.1,23.6 38,16.7 38,14.15 41.55,10.6 45.95,10.6 51,5.55 62.1,5.55 62.5,5.15 62.5,4.65 v63.05,4.1
  Bottom 0.254: X1.178 58.85,2.95 59.8,3.9 62.85,3.9 v63.05,4.1
FB_5$3  (via drill 0.2)
  Top 0.254: U7.13 v64.8,33.2
  Bottom 0.406: R75.1 64.1,33.2 | 64.1,33.2 v64.8,33.2 | R76.1 64.1,32.84 64.1,33.2
  pour Top: 64.75,32.35 64.75,33.7 66.35,33.7 66.35,32.35
FB_5A$3
  Bottom 0.406: C58.2 R76.2
GND  (via drill 0.2)  (24 unrouted)
  Top 0.102: J1.43 31.15,7.51 31.15,7.85 31.7,8.4 31.95,8.4 | J1.7 23.9,8.05 23.75,8.2 22.65,8.2 v22.25,7.8
  Top 0.2: J1.32 v28.7,9.95 | J1.22 26.7,9.8 | J1.14 25.1,9.8 25.25,9.65 v25.25,9.4 25.9,9.4 26.15,9.15 26.15,8.5 | J1.8 23.9,9.8 | J2.13 25.1,42.1 25,42.2 24.05,42.2 23.9,42.05 J2.7 | J2.19 26.3,42.25 | J2.25 27.5,42.15 | J2.31 28.7,42.15 | J2.37 29.9,42.2 | J2.80 38.3,45.05 38.7,45.45 v38.9,45.45 39.1,45.45 39.5,45.05 J2.86 | J2.92 40.7,45.05 41.1,45.45 v41.3,45.45 41.5,45.45 41.9,45.05 J2.98 | J2.97 41.9,42.15 42,42.25 42.75,42.25 v43,42 | J2.74 37.1,45.05 36.7,45.45 v36.5,45.45 36.3,45.45 35.9,45.05 J2.68 | J2.62 34.7,45.05 34.3,45.45 v34.1,45.45 33.9,45.45 33.5,45.05 J2.56 | J2.50 32.3,45.05 31.9,45.45 v31.7,45.45 31.5,45.45 31.1,45.05 J2.44 | J2.38 29.9,45.05 29.5,45.45 v29.3,45.45 29.1,45.45 28.7,45.05 J2.32 | J2.26 27.5,45.05 27.1,45.45 v26.9,45.45 26.7,45.45 26.3,45.05 J2.20 | J2.14 25.1,45.05 24.7,45.45 v24.5,45.45 24.3,45.45 23.9,45.05 J2.8 | J2.91 40.7,42.25 | J2.85 39.5,42.25 | J2.79 38.3,42.25 | J2.73 37.1,42.25 | J2.67 35.9,42.2 | J2.61 34.7,42.2 | J2.55 33.5,42.2 | J1.13 25.1,7.95 25.25,8.1 25.75,8.1 26.15,8.5 | J1.23 27.1,7.9 26.9,8.1 26.55,8.1 26.15,8.5
  Top 0.254: X1.1 v2.15,4.45 | v8.43,16 U1.P9 6.32,16 6.07,16.25 | J1.1 22.59,7.46 v22.25,7.8 | J1.2 21.61,10.54 v20.8,11.35 | X1.91 32.85,1.5 32.85,3.3 v32.7,3.45 | X1.97 34.55,3.25 | X1.195 63.95,2.9 v64.1,3.05 | X1.7 3.95,2.7 v4.25,3 | X1.13 5.75,2.7 v6.05,3 | X1.19 7.55,2.7 v7.85,3 | X1.25 9.35,2.7 v9.65,3 | X1.31 11.15,2.8 v11.35,3 | X1.37 12.95,2.95 v13,3 | X1.49 v20.15,3 | X1.55 21.95,2.75 v22.15,2.95 | X1.61 23.75,2.65 v24.05,2.95 | X1.67 25.55,2.75 v25.7,2.9 | X1.73 27.35,2.8 v27.45,2.9 | X1.79 29.15,2.85 v29.3,3 | X1.85 30.95,2.9 v31,2.95 | X1.43 18.35,2.9 v18.45,3 | X1.151 50.75,3.85 51.5,4.6 v51.5,6.6 54,9.1 MP2.1 | X1.181 59.75,2.8 v59.95,3 | X1.187 61.55,2.95 v61.65,3.05 | v54.55,3.7 54.45,3.6 54.45,2.15 54.35,2.05 X1.163
  Bottom 0.254: v4.05,16.25 4.05,16.33 3.77,16.61 C1.2 | X1.196 64.25,2.9 v64.1,3.05 | X1.182 60.05,1.42 60.05,2.95 59.99,3 v59.95,3 | X1.8 v4.25,3 | X1.14 v6.05,3 | X1.20 v7.85,3 | X1.26 v9.65,3 | X1.32 11.45,2.9 v11.35,3 | X1.38 13.25,2.75 v13,3 | X1.50 20.45,2.7 v20.15,3 | X1.56 22.25,2.85 v22.15,2.95 | X1.62 v24.05,2.95 | X1.68 25.85,2.75 v25.7,2.9 | X1.74 27.65,2.7 v27.45,2.9 | X1.80 29.45,2.85 v29.3,3 | X1.86 31.25,2.7 v31,2.95 | X1.44 18.65,2.8 v18.45,3 | X1.188 61.85,2.6 61.65,2.8 v61.65,3.05 | X1.164 54.55,1.5 v54.55,3.7 | X1.92 32.95,1.5 32.95,3.2 v32.7,3.45
  other vias: 1,1.4 1,2 1,2.6 33.5,43.7 64,25.3 62,36.2 62,35.6 31.6,42.17 62,35 62.75,38 62.75,39 62.75,40 66.75,30.25 3.15,20.65 4.55,15.05 37.25,11.3 60.6,11.75 4.35,6.75 9.9,8.6 33.05,5.25 31.65,39.67 57.8,15.87 32,29.67 31.05,32.37 16,44.72 4.05,38.47 1.8,29.32 62.15,44.8 66,40.6 8.55,36.22 11.7,37.32 14.7,38.27 13,26.82
  pour Top (rank 6): 0,0 0,46.45 67.5,46.45 67.5,0
  pour GND (rank 6): 0,0 0,46 67.5,46 67.5,0
  pour Bottom (rank 6): 0,0 0,46 67.5,46 67.5,0
  pour Bottom (rank 2): 0,12.5 0,0 15,0 15,5.2 17,5.2 17,0 67.5,0 67.5,12.5
  pour Top (rank 5): 57,44 3,44 3,5 57,5
  pour Bottom (rank 5): 57,44 3,44 3,5 57,5
  pour Top (rank 2): 57.55,46 57.55,27.5 68.05,27.5 68.05,46
  pour Bottom (rank 2): 57.55,46 57.55,27.5 68.05,27.5 68.05,46
  pour Top: 8.3,13.05 1.9,13.05 1.9,19.45 8.3,19.45
  pour Bottom: 8.3,13.05 1.9,13.05 1.9,19.45 8.3,19.45
  pour Power (rank 6): 0,0 0,46 67.5,46 67.5,0
GPIO0$1  (via drill 0.2)
  Top 0.102: X1.3 2.9,1.55 2.9,4.5 3.55,5.15 v4.25,5.15 | J1.36 29.5,9.7 | 29.5,9.7 | v27.35,9.8 27.35,9.6 27.7,9.25 29.05,9.25 29.45,9.65 29.46,9.65 29.46,9.7 29.5,9.7
  S3 0.102: v27.35,9.8 27.33,9.8 27.33,10.16 18.69,18.8 18.3,18.8 17.55,19.55 17.55,19.75 17.15,20.15 15.9,20.15 15.6,19.85 15.6,19.5 14.9,18.8 11.54,18.8 11.53,18.8 11.28,19.05 10.87,19.05 3.71,11.89 3.71,5.69 4.22,5.18 v4.25,5.15
GPIO0-27_VDD$1  (via drill 0.2)
  Top 0.254: X1.39 13.55,2.55 v14,3
  Bottom 0.254: v14,3 13.85,2.85 X1.40
  pour Power: 3.35,7.9 54.05,7.9 54.05,0.65 3.35,0.75
GPIO1$1  (via drill 0.2)
  Top 0.102: X1.5 3.35,3.95 3.7,4.3 v4.25,4.3 | J1.35 v29.5,8.14
  S3 0.102: v29.5,8.14 29.52,8.13 29.87,8.13 30.28,7.72 31.9,7.72 33.53,6.1 33.53,3.66 32.11,2.23 17.52,2.23 17.2,2.55 17.2,3.2 17.22,3.22 17.22,4.42 16.66,4.98 15.58,4.98 14.1,3.5 13.45,3.5 13.35,3.6 11.98,3.6 11.79,3.4 11.79,2.79 11.53,2.54 7.67,2.54 6.5,3.71 6.5,5.03 6.25,5.28 5.23,5.28 4.27,4.32 v4.25,4.3
GPIO2$1  (via drill 0.2)
  Top 0.102: X1.9 4.7,1.55 4.7,3.5 4.55,3.65 v4.25,3.65 | J1.58 33.9,11.35 34.35,11.8 v36.85,11.8 | v3.71,20.07 v1.27,17.63 1.52,17.38 v2.27,17.38 2.65,17 U1.P20
  S3 0.102: v32.21,18.39 22.61,18.39 19.15,21.84 v14.22,21.84 | v12.75,22.05 5.69,22.05 v3.71,20.07
  S14 0.102: v32.21,18.39 36.83,13.77 36.83,11.84 v36.85,11.8 | v14.22,21.84 12.95,21.84 v12.75,22.05 | v1.27,17.63 1.27,14.22 0.61,13.56 0.61,5.03 3.3,2.34 5.99,2.34 6.5,2.85 6.5,4.01 6.2,4.32 4.93,4.32 4.27,3.66 v4.25,3.65
  Bottom 0.102: R7.1 2.68,17.38 v2.27,17.38
GPIO3$1  (via drill 0.2)
  Top 0.102: X1.11 5.1,1.45 5.1,5.3 5.6,5.8 6.87,5.8 9.45,8.38 9.45,9.3 14.81,14.66 v14.81,19.56 | J1.56 33.5,11.3 32.85,11.95 29.2,11.95 20.7,20.45 v18,20.45 | U1.P19 2.62,18 v2.27,18
  S3 0.102: v18,20.45 17.98,20.42 15.37,20.42 14.81,19.86 v14.81,19.56
  S14 0.102: v14.81,19.56 14.81,19.52 12.8,17.5 3.39,17.5 R8.1 2.3,17.97 v2.27,18
  Bottom 0.102: R8.1 2.89,18 v2.27,18
GPIO4$1  (via drill 0.2)
  Top 0.102: X1.15 6.35,2.55 6.55,2.75 6.55,3.35 v6.05,3.85 | J1.54 33.1,11.3 32.7,11.7 29.05,11.7 21,19.75 v18.05,19.75
  S14 0.102: v6.05,3.85 6.04,3.81 5.69,3.81 4.42,2.54 3.4,2.54 0.81,5.13 0.81,13.46 1.68,14.33 12.65,14.33 18.03,19.71 v18.05,19.75
GPIO5$1  (via drill 0.2)
  Top 0.102: X1.17 6.95,3.95 v6.05,4.85 | J1.34 arc-90 29.15,10.49 29.15,9.75 28.9,9.5 28.35,9.5 v28.05,9.8
  S3 0.102: v28.05,9.8 v28.04,9.8 28.04,11.43 18.29,21.18 12.7,21.18 3.5,11.99 3.5,3.1 4.06,2.54 4.42,2.54 5.59,3.71 5.59,4.37 6.04,4.83 v6.05,4.85
GPIO6$1
  Top 0.102: X1.21 8.15,2.6 8.35,2.8 8.35,3.3 7.42,4.23 7.42,5.49 11.73,9.8 11.73,11.28 18.51,18.05 21.7,18.05 28.3,11.45 J1.30
GPIO7$1  (via drill 0.2)
  Top 0.102: X1.23 8.65,1.5 8.65,3.9 7.9,4.65 v7.85,4.65 | J1.37 29.9,7.95 30,8.05 30.55,8.05 v30.7,8.2
  S3 0.102: v18.95,12.85 14.99,12.85 14.38,13.46 9.14,13.46 8.33,12.65 8.33,5.13 7.87,4.67 v7.85,4.65
  S14 0.102: v18.95,12.85 27.23,12.85 30.68,9.4 30.68,8.23 v30.7,8.2
GPIO8$1  (via drill 0.2)
  Top 0.102: X1.27 9.95,2.6 10.15,2.8 10.15,3.4 v9.75,3.8 | J1.39 30.3,6.9 30.2,6.8 29.65,6.8 v29.2,6.35
  S3 0.102: v29.2,6.35 29,6.55 27.6,6.55 27.15,6.1 27.15,4.8 27,4.65 27,4.1 26.65,3.75 26.35,3.75 26.05,4.05 25.45,4.05 24.8,3.4 23.85,3.4 23.75,3.3 23.2,3.3 23.05,3.45 23.05,3.75 22.85,3.95 22.65,3.95 22.55,4.05 22.2,4.05 22.1,3.95 21.95,3.95 20.55,2.55 19.85,2.55 18.95,3.45 17.9,3.45 17.75,3.6 17.75,4.65 17.1,5.3 15.25,5.3 v13.9,3.95
  S14 0.102: v9.75,3.8 10.7,2.85 10.7,2.75 11.2,2.25 14.05,2.25 14.75,2.95 14.75,3.25 14.05,3.95 v13.9,3.95
GPIO9$1  (via drill 0.2)
  Top 0.102: X1.29 10.7,1.55 v10.7,5.05 | J1.40 30.35,10.49 30.35,9.3 30.25,9.2 29.85,9.2 29.45,8.8 28.45,8.8 28.3,8.65 27.8,8.65 27.65,8.5 v27.2,8.5
  S3 0.102: v20.07,11.33 16.66,11.33 v15.75,10.41 | v14.55,5.74 11.99,5.74 11.58,6.15 11.23,6.15 10.72,5.64 10.72,5.08 v10.7,5.05
  S14 0.102: v20.07,11.33 21.08,12.34 27.13,12.34 27.48,11.99 27.48,10.97 26.67,10.16 26.67,8.79 26.96,8.5 v27.2,8.5 | v14.55,5.74 14.55,9.21 v15.75,10.41
GPIO10$1  (via drill 0.2)
  Top 0.102: X1.33 11.75,2.6 11.9,2.75 11.9,3.35 11.8,3.45 11.7,3.45 11.38,3.77 11.38,4.98 10.92,5.44 10.92,5.84 11.28,6.2 15.9,6.2 16.36,5.74 18.8,5.74 v19.1,5.44 | J1.44 31.15,10.49 31.15,9.25 30.85,8.95 29.93,8.95 29.55,8.57 29.15,8.57 28.78,8.2 v28.1,8.2
  S14 0.102: v28.1,8.2 28.09,8.18 27.74,8.18 27.33,7.77 25.53,7.77 24.8,8.5 24.8,8.7 24.55,8.95 24.35,8.95 24,9.3 22.56,9.3 19.1,5.84 v19.1,5.44
GPIO11$1  (via drill 0.2)
  Top 0.102: X1.35 12.35,5.05 v12.1,5.3 | J1.38 29.95,10.49 29.9,10.44 29.9,9.65 29.27,9.03 27.23,9.03 v27.1,9.15
  S14 0.102: v24.38,8.38 25.2,7.57 28.09,7.57 28.55,8.03 28.55,8.38 27.78,9.15 v27.1,9.15
  Bottom 0.102: v24.38,8.38 24.03,8.38 22.7,7.05 19.65,7.05 19,6.4 13.21,6.4 12.14,5.33 v12.1,5.3
GPIO12$1  (via drill 0.2)
  Top 0.102: J1.31 v28.7,6 | X1.45 18.95,3.3 v18.25,4
  Bottom 0.102: v18.25,4 18.24,4.11 18.24,5.39 18.75,5.9 19.25,5.9 19.85,6.5 24.6,6.5 25.15,5.95 26,5.95 26.35,5.6 27.05,5.6 27.2,5.75 27.2,6.35 27.35,6.5 28.2,6.5 v28.7,6
GPIO13$1
  Top 0.102: X1.47 19.45,1.4 19.45,4.05 19.61,4.21 19.61,5.74 18.95,6.4 13.87,6.4 11.94,8.33 11.94,11.18 18.56,17.8 21.65,17.8 27.9,11.55 J1.28
GPIO14$1  (via drill 0.2)
  Top 0.102: X1.51 20.6,1.55 20.6,3.25 20.4,3.45 v20.4,4.5 | J1.55 33.5,6.5 v32.95,5.95
  S3 0.102: v32.95,5.95 32.92,5.99 32.92,6.4 31.8,7.52 24.28,7.52 23.57,8.23 v23.57,8.68
  S14 0.102: v20.4,4.5 20.42,4.52 20.57,4.67 20.57,6.76 22.5,8.68 v23.57,8.68
GPIO15$1  (via drill 0.2)
  Top 0.102: X1.53 21.35,4.35 v21.25,4.45 | J1.51 32.7,6.4 32.3,6 v32.2,6
  S3 0.102: v20.12,5.08 20.62,5.08 21.23,4.47 v21.25,4.45
  S14 0.102: v20.12,5.08 20.04,5 18.85,5 18.6,5.25 18.6,5.53 18.03,6.1 18.03,12.55 18.8,13.31 27.08,13.31 32.7,7.69 32.7,6.5 v32.2,6
GPIO16$1  (via drill 0.2)
  Top 0.102: X1.57 22.7,1.55 22.7,3.15 22.35,3.5 v22.35,3.6 | J1.29 28.25,7.41 28.25,6.1 28.2,6.05 28.2,5.7 v28.55,5.35
  S3 0.102: v28.55,5.35 28.55,4.9 28,4.35 28,2.7 27.75,2.45 25.87,2.45 25.86,2.44 23.52,2.44 v22.36,3.6 v22.35,3.6
GPIO17$1  (via drill 0.2)
  Top 0.102: X1.59 23.3,1.55 23.3,4 v23.75,4.45 | J1.50 32.25,10.59 32.25,11.15 31.95,11.45 28.95,11.45 21.15,19.25 19.6,19.25 19.1,18.75 18.2,18.75 17.53,19.42 v17.53,24.49
  S14 0.102: v17.53,24.49 31.9,24.49 41.7,14.69 41.7,12.1 40.95,11.35 40.95,11 41.75,10.2 41.75,7.87 35.97,2.08 28.97,2.08 27.75,3.3 27.75,3.7 27.6,3.85 27.4,3.85 27.05,4.2 27.05,4.55 26.9,4.7 26.05,4.7 25.65,4.3 24.75,4.3 24.6,4.45 v23.75,4.45
GPIO18$1  (via drill 0.2)
  Top 0.102: X1.63 24.5,1.55 24.5,4.7 25.3,5.5 25.3,5.85 25.55,6.1 v26.65,6.1 | J1.49 32.3,6.8 v32.1,6.6
  S14 0.102: v26.65,6.1 27.4,6.85 30.8,6.85 31.05,6.6 v32.1,6.6
GPIO19$1  (via drill 0.2)
  Top 0.102: X1.65 25.1,1.55 25.1,3.2 25.25,3.35 v25.25,4.75 | J1.26 27.55,10.59 27.55,11.35 27.06,11.84 26.67,11.84 21.49,17.02 19.25,17.02 v14.43,12.19
  S3 0.102: v14.43,12.19 14.43,11.94 14.38,11.89 14.38,10.72 18.09,7.01 21.49,7.01 23.42,5.08 24.94,5.08 25.25,4.78 v25.25,4.75
GPIO20$1  (via drill 0.2)
  Top 0.102: X1.69 26.2,1.45 26.2,3.15 v25.75,3.6 | J1.27 27.95,7.41 27.95,6.25 v27.7,6
  Bottom 0.102: v25.75,3.6 25.75,4.2 26.5,4.95 26.9,4.95 27.7,5.75 v27.7,6
GPIO21$1
  Top 0.102: 26.9,1.55 X1.71 26.75,2.55 26.6,2.7 26.6,3.5 26.05,4.05 26.05,4.7 26.5,5.15 27.05,5.15 27.2,5.3 27.2,6.45 27.5,6.75 J1.25
GPIO22$1  (via drill 0.2)
  Top 0.102: X1.75 28.1,1.55 28.1,3.45 27.55,4 v27.55,4.35 | J1.46 31.5,9.05 31.1,8.65 30.3,8.65 v30.15,8.5
  S14 0.102: v30.15,8.5 30.12,8.48 30.12,8.08 29.25,7.2 25.15,7.2 24.8,6.85 24.8,6.65 25.45,6 25.95,6 27,4.95 27.15,4.95 27.55,4.55 v27.55,4.35
GPIO23$1
  Top 0.102: X1.77 28.4,1.55 28.4,3.6 28.3,3.7 28.3,4.35 29.15,5.2 29.8,5.2 30.55,5.95 31.15,5.95 31.6,6.4 31.6,6.8 31.9,7.1 J1.47
GPIO24$1  (via drill 0.2)
  Top 0.102: X1.81 29.75,3.25 29.25,3.75 v29.25,4.6 | J1.45 31.5,7.1 31.35,6.95 31.35,6.6 30.95,6.2 30.45,6.2 30.15,5.9 29.7,5.9 29.5,5.7 v29.25,5.7
  Bottom 0.102: v29.25,5.7 v29.25,4.6
GPIO25$1  (via drill 0.2)
  Top 0.102: X1.83 30.35,3.5 30.15,3.7 30.15,4.65 v30.05,4.75 | J1.41 30.7,6.85 30.2,6.35 v29.95,6.35
  Bottom 0.102: v29.95,6.35 29.95,4.85 v30.05,4.75
GPIO26$1  (via drill 0.2)
  Top 0.102: X1.87 31.55,3.35 31.65,3.45 v31.8,3.45 | J1.24 27.05,10.59 v27.05,11.19
  S3 0.102: v24.63,9.65 23.77,9.65 23.01,8.89 23.01,8.33 24.18,7.16 29.77,7.16 30.43,6.5 30.43,6.2 29.31,5.08 29.11,5.08 28.35,4.32 28.35,3.81 28.7,3.45 31.75,3.45 v31.8,3.45
  S14 0.102: v27.05,11.19 27.03,11.18 25.91,11.18 24.63,9.9 v24.63,9.65
GPIO27$1  (via drill 0.2)